# Altium project SFP_RFoF.PrjPcb (part 1 of 2)
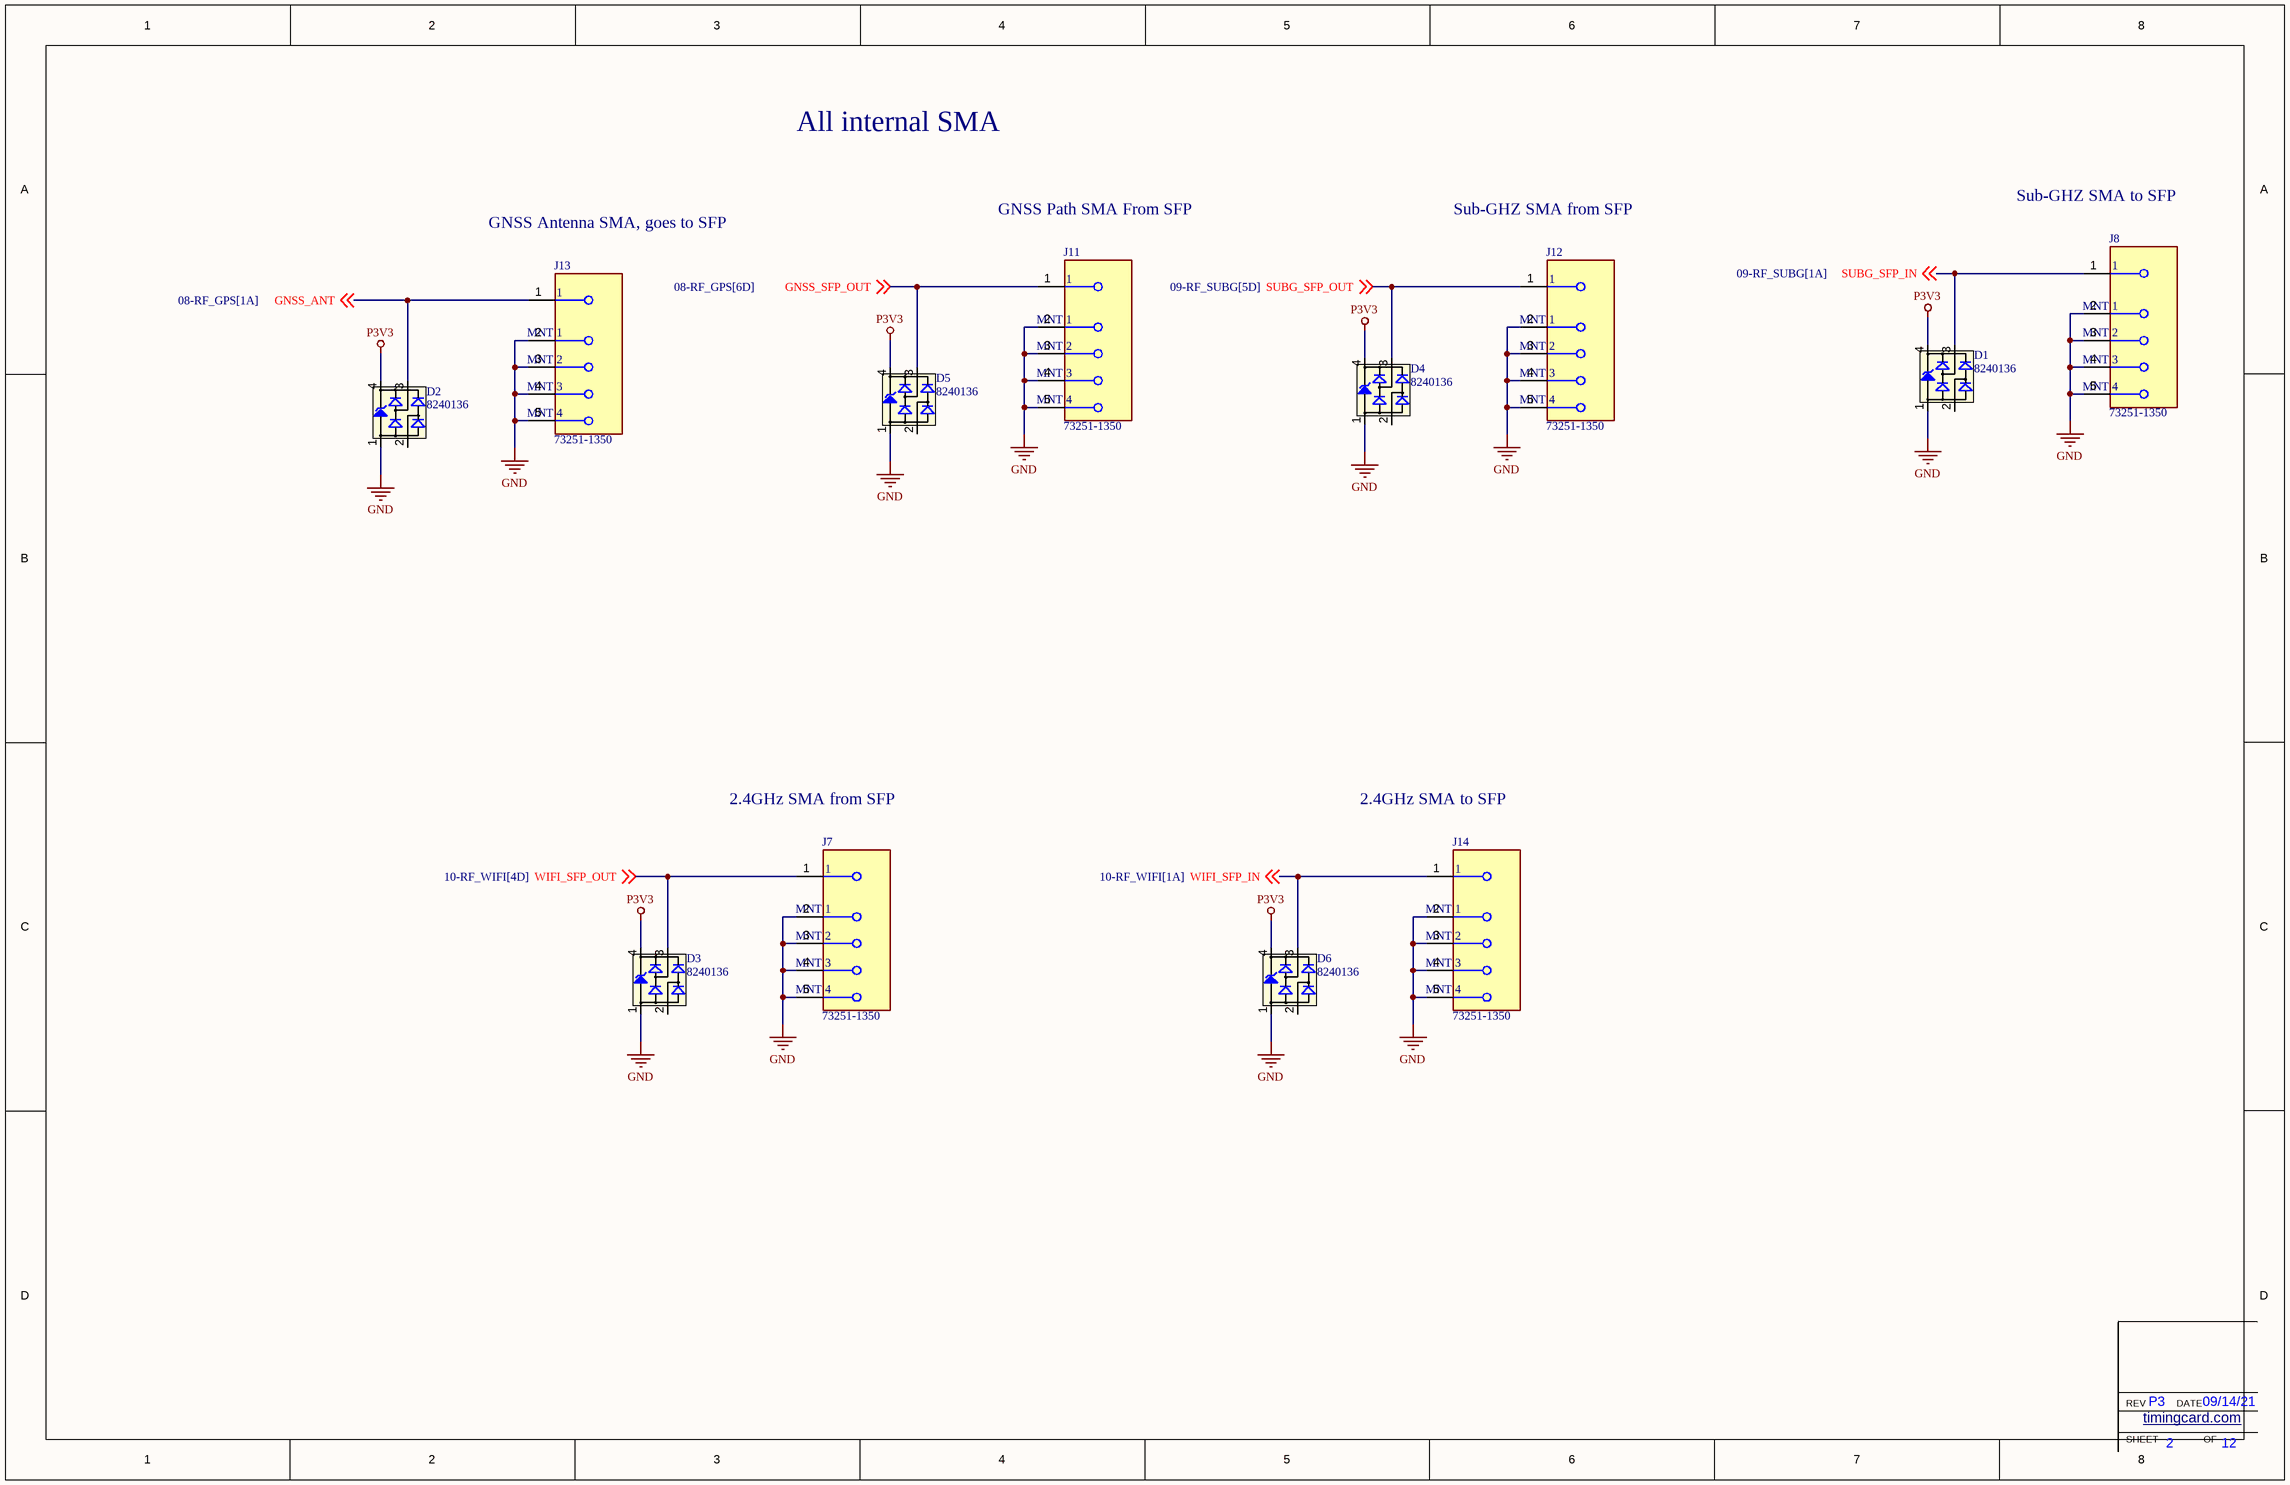
[diagram p0: 02-USER_IO.SchDoc]
ProjectDate: 09/14/21; ProjectRevision: P3
8 sheets, 226 parts. Net scope: global (net labels, ports and power ports of the same name join across sheets).
Board file: SFP_RFoF.PcbDoc
Sheets:
  02-USER_IO.SchDoc
  04-Front Panel SFP_2.SchDoc
  05-General I2C Devices.SchDoc
  06-I225-1.SchDoc
  07-I225-2.SchDoc
  08-RF_GPS.SchDoc
  09-RF_SUBG.SchDoc
  10-RF_WIFI.SchDoc

## Sheet 02-USER_IO.SchDoc
size Tabloid; DocumentNumber: 1; SheetNumber: 2; SheetTotal: 12

### Parts
D1  8240136  [SOT143-4L]
D2  8240136  [SOT143-4L]
D3  8240136  [SOT143-4L]
D4  8240136  [SOT143-4L]
D5  8240136  [SOT143-4L]
D6  8240136  [SOT143-4L]
J7  73251-1350  [FP-73251-1350-MFG]
J8  73251-1350  [FP-73251-1350-MFG]
J11  73251-1350  [FP-73251-1350-MFG]
J12  73251-1350  [FP-73251-1350-MFG]
J13  73251-1350  [FP-73251-1350-MFG]
J14  73251-1350  [FP-73251-1350-MFG]

### Nets
GND: D1.1(GND) D2.1(GND) D3.1(GND) D4.1(GND) D5.1(GND) D6.1(GND) J7.2(MNT_1) J7.3(MNT_2) J7.4(MNT_3) J7.5(MNT_4) J8.2(MNT_1) J8.3(MNT_2) J8.4(MNT_3) J8.5(MNT_4) J11.2(MNT_1) J11.3(MNT_2) J11.4(MNT_3) J11.5(MNT_4) J12.2(MNT_1) J12.3(MNT_2) J12.4(MNT_3) J12.5(MNT_4) J13.2(MNT_1) J13.3(MNT_2) J13.4(MNT_3) J13.5(MNT_4) J14.2(MNT_1) J14.3(MNT_2) J14.4(MNT_3) J14.5(MNT_4)
P3V3: D1.4(VDD) D2.4(VDD) D3.4(VDD) D4.4(VDD) D5.4(VDD) D6.4(VDD)
GNSS_ANT: D2.3(I/O2) J13.1 ; off-sheet GNSS_ANT
GNSS_SFP_OUT: D5.3(I/O2) J11.1 ; off-sheet GNSS_SFP_OUT
SUBG_SFP_IN: D1.3(I/O2) J8.1 ; off-sheet SUBG_SFP_IN
SUBG_SFP_OUT: D4.3(I/O2) J12.1 ; off-sheet SUBG_SFP_OUT
WIFI_SFP_IN: D6.3(I/O2) J14.1 ; off-sheet WIFI_SFP_IN
WIFI_SFP_OUT: D3.3(I/O2) J7.1 ; off-sheet WIFI_SFP_OUT

Not connected (* = marked no-connect by the designer): D1 2(I/O1); D2 2(I/O1); D3 2(I/O1); D4 2(I/O1); D5 2(I/O1); D6 2(I/O1)

### Notes on the sheet
- All internal SMA
- GNSS Antenna SMA, goes to SFP
- GNSS Path SMA From SFP
- Sub-GHZ SMA from SFP
- Sub-GHZ SMA to SFP
- 2.4GHz SMA from SFP
- 2.4GHz SMA to SFP
- SHEET
- REV
- timingcard.com <http://timingcard.com>
- DATE
- OF

### Library data of the parts
D1-D6 = CMP-1486-00002-1: TVS Diode WE-TVS-HS, VRWM=3.3V; Manufacturer: Wuerth Elektronik; Reverse Stand Off Voltage: 3.3V; PartNumber: 8240136; ComponentLink1Description: Manufacturer URL; PackageReference: SOT143-4L; ComponentLink1URL: http://www.we-online.com; ComponentLink2Description: Datasheet; ComponentLink2URL: http://katalog.we-online.de/kataloge/eisos/media/pdf/8240136.pdf
J7 J8 J11-J14 = CMP-04764-000006-1: CONN SMA JACK STR 50 OHM SMD; Manufacturer: Molex; Is Female: yes; Standoff Height: 0.41mm; Impedance: 50Ω; Number Of Contacts: 1; Conn Orientation: Straight; Voltage Rating: 500V; Shielding: true; Frequency: 18GHz; Package: 73251-1350; Device Class L1: Connectors; Category: Conn; Manufacturer Part Number: 73251-1350; ComponentLink2URL: https://www.molex.com/pdm_docs/sd/732511350_sd.pdf; Automotive: No; Height: 9.655mm; Octopart: https://octopart.com/73251-1350-molex-5414390; Footprint Url: https://forum.upverter.com/uploads/default/original/3X/d/a/daeafa2ce4908d4fc4e49f0b17d7d2c986fce444.pdf; Temperature Range High: +165°C; Device Class L3: unset; Mouser Description: RF Connectors / Coaxial Connectors SMA ST PCB-JCK STD SMT; Lead Free: Yes; Temperature: -65°C to +165°C; RoHS: TRUE; ComponentLink2Description: Datasheet; Device Class L2: RF / Coaxial Connectors; Digikey Description: CONN SMA JACK STR 50 OHM SMD; Contact Material: Gold; Temperature Range Low: -65°C

## Sheet 04-Front Panel SFP_2.SchDoc
size B; SheetNumber: 4; SheetTotal: 12
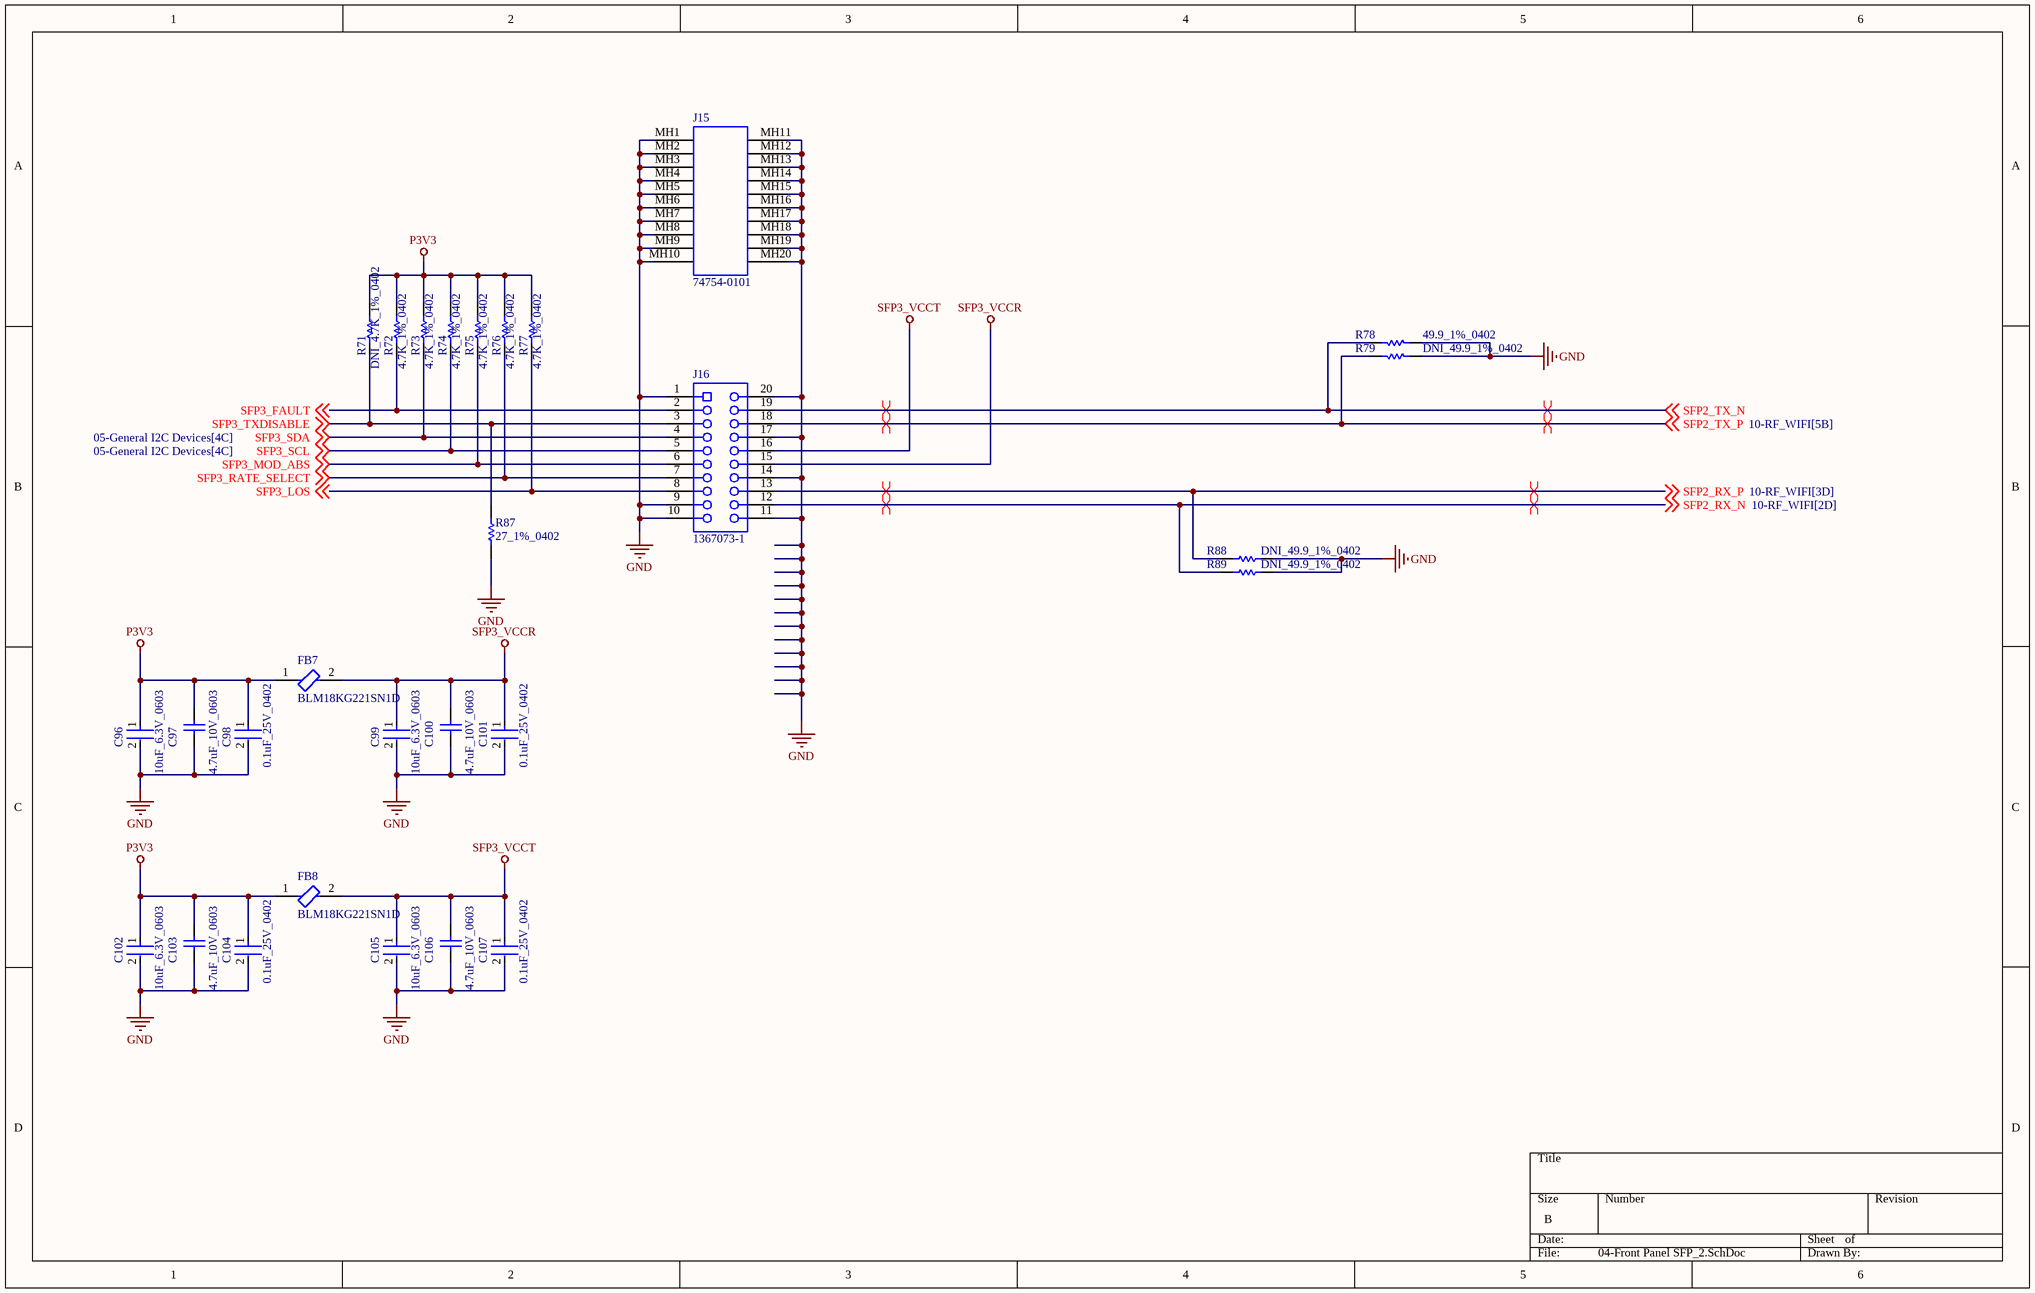
[diagram p1: 04-Front Panel SFP_2.SchDoc]

### Parts
C96  10uF_6.3V_0603  [FP-C0603C106M9PACTU-MFG]
C97  4.7uF_10V_0603  [CAPC1608X87X35NL15T15]
C98  0.1uF_25V_0402  [FP-0402-L_1_0_1-W_0_5_0_1-IPC_C]
C99  10uF_6.3V_0603  [FP-C0603C106M9PACTU-MFG]
C100  4.7uF_10V_0603  [CAPC1608X87X35NL15T15]
C101  0.1uF_25V_0402  [FP-0402-L_1_0_1-W_0_5_0_1-IPC_C]
C102  10uF_6.3V_0603  [FP-C0603C106M9PACTU-MFG]
C103  4.7uF_10V_0603  [CAPC1608X87X35NL15T15]
C104  0.1uF_25V_0402  [FP-0402-L_1_0_1-W_0_5_0_1-IPC_C]
C105  10uF_6.3V_0603  [FP-C0603C106M9PACTU-MFG]
C106  4.7uF_10V_0603  [CAPC1608X87X35NL15T15]
C107  0.1uF_25V_0402  [FP-0402-L_1_0_1-W_0_5_0_1-IPC_C]
FB7  BLM18KG221SN1D  [FP-BLM18-0_15-t0_8-IPC_B]
FB8  BLM18KG221SN1D  [FP-BLM18-0_15-t0_8-IPC_B]
J15  74754-0101  [MOLX-74754-0101_V]
J16  1367073-1  [TECO-1367073-1_V]
R71  DNI_4.7K_1%_0402  [RESC1005X40X25NL10T10]  (no BOM)
R72  4.7K_1%_0402  [RESC1005X40X25NL10T10]
R73  4.7K_1%_0402  [RESC1005X40X25NL10T10]
R74  4.7K_1%_0402  [RESC1005X40X25NL10T10]
R75  4.7K_1%_0402  [RESC1005X40X25NL10T10]
R76  4.7K_1%_0402  [RESC1005X40X25NL10T10]
R77  4.7K_1%_0402  [RESC1005X40X25NL10T10]
R78  49.9_1%_0402  [RESC1005X40X25NL10T10]
R79  DNI_49.9_1%_0402  [RESC1005X40X25NL10T10]  (no BOM)
R87  27_1%_0402  [RESC1005X40X25NL05T05]
R88  DNI_49.9_1%_0402  [RESC1005X40X25NL10T10]  (no BOM)
R89  DNI_49.9_1%_0402  [RESC1005X40X25NL10T10]  (no BOM)

### Nets
GND: C96.2 C97.1 C98.2 C99.2 C100.1 C101.2 C102.2 C103.1 C104.2 C105.2 C106.1 C107.2 J15.MH1 J15.MH2 J15.MH3 J15.MH4 J15.MH5 J15.MH6 J15.MH7 J15.MH8 J15.MH9 J15.MH10 J15.MH11 J15.MH12 J15.MH13 J15.MH14 J15.MH15 J15.MH16 J15.MH17 J15.MH18 J15.MH19 J15.MH20 J16.1 J16.9 J16.10 J16.11 J16.14 J16.17 J16.20 R78.2 R79.2 R87.1 R88.2 R89.2
P3V3: C96.1 C97.2 C98.1 C102.1 C103.2 C104.1 FB7.1 FB8.1 R71.1 R72.1 R73.1 R74.1 R75.1 R76.1 R77.1
SFP3_VCCR: C99.1 C100.2 C101.1 FB7.2 J16.15
SFP3_VCCT: C105.1 C106.2 C107.1 FB8.2 J16.16
SFP2_RX_N: J16.12 R89.1 ; off-sheet SFP2_RX_N
SFP2_RX_P: J16.13 R88.1 ; off-sheet SFP2_RX_P
SFP2_TX_N: J16.19 R78.1 ; off-sheet SFP2_TX_N
SFP2_TX_P: J16.18 R79.1 ; off-sheet SFP2_TX_P
SFP3_FAULT: J16.2 R72.2 ; off-sheet SFP3_FAULT
SFP3_LOS: J16.8 R77.2 ; off-sheet SFP3_LOS
SFP3_MOD_ABS: J16.6 R75.2 ; off-sheet SFP3_MOD_ABS
SFP3_RATE_SELECT: J16.7 R76.2 ; off-sheet SFP3_RATE_SELECT
SFP3_SCL: J16.5 R74.2 ; off-sheet SFP3_SCL
SFP3_SDA: J16.4 R73.2 ; off-sheet SFP3_SDA
SFP3_TXDISABLE: J16.3 R71.2 R87.2 ; off-sheet SFP3_TXDISABLE

### Layout directives
differential pair: SFP2_RX_N, SFP2_RX_P, SFP2_TX_N, SFP2_TX_P

### Library data of the parts
C96 C99 C102 C105 = CMP-2006-02285-3: CAP CER 10UF 6.3V X5R 0603; Manufacturer Part Number: C0603C106M9PACTU; Manufacturer: Kemet; Material: Ceramic; Temperature Coefficient: 15%; Tolerance: 20%; Category: Cap; Height: 0.9mm; Digikey Description: CAP CER 10UF 6.3V X5R 0603; Mouser Description: In a Pack of 10, KEMET 0603 (1608M) 10µF MLCC 6.3V dc ±20% SMD C0603C106M9PACTU; Voltage Rating: 6.3V; Device Class L2: Capacitors; Temperature Range Low: -55°C; Temperature Characteristic: X5R; ComponentLink2Description: Datasheet; Ipc Land Pattern Name: CAPC16080X80; ComponentLink2URL: http://www.kemet.com/Lists/ProductCatalog/Attachments/19/KEM_C1006_X5R_SMD.pdf; Capacitance: 10uF; Temperature Range High: +85°C; Device Class L3: Ceramic Capacitors; RoHS: TRUE; Automotive: No; Value: 10uF; Temperature: -55°C to +85°C; Device Class L1: Passive Components; Package: C0603C106M9PACTU; Lead Free: Yes; Octopart: https://octopart.com/c0603c106m9pactu-kemet-8375727
C97 C100 C103 C106 = CMP-2006-03238-1: Part Number: C0603C475K8PACTU; Manufacturer: Kemet
C98 C101 C104 C107 = CMP-2008-02519-2: General Purpose Ceramic Capacitor, 0402, 100nF, 10%, X7R, 15%, 25V; Package Quantity: 1; Capacitance: 100nF; Min Operating Temperature: -55°C; Voltage: 25V; Voltage Rating: 25V; Construction: Flat; Max Operating Temperature: 125°C; Radiation Hardening: No; Depth: 0.5mm; Thickness: 0.022inch; Voltage Rating (DC): 25V; Number of Pins: 2; Lead Free: Lead Free; Series: -; REACH SVHC: No SVHC; Length: 1mm; Dielectric: X7R; RoHS Compliant: Yes; Mount: Surface Mount; Packaging: Tape and Reel; Case/Package: 0402; Case Code (Imperial): 0402; Termination: SMD/SMT; Width: 0.02inch; Case Code (Metric): 1005; Tolerance: 10%
FB7 FB8 = CMP-0686-00556-7: Chip Ferrite Bead, 0603, 220Ω @ 100MHz, 0.05Ω, 25%, 2.2A; DC Resistance (DCR): 50mR; Number of Circuits: 1; Impedance: 220R; Current Rating: 2.2A; Material: Ferrite; Test Frequency: 100MHz; Depth: 0.8mm; Series: BLM18K; RoHS Compliant: Yes; Termination: SMD/SMT; Max Current Rating: 2.2A; Case Code (Metric): 1608; Radiation Hardening: No; Number of Pins: 2; Length: 1.6mm; Lead Free: Lead Free; Package Quantity: 1; Height: 0.8mm; Core Material: Ferrite; Inductor Type: FERRITE BEAD; Min Operating Temperature: -55°C; Case/Package: 0603; Case Code (Imperial): 0603; Number of Lines: 1; Packaging: Tape and Reel; REACH SVHC: No SVHC; Max Operating Temperature: 125°C; Military Standard: Not; DC Resistance-Max: 50mR; Width: 0.8mm; DC Current: 2.2A; Max DC Current: 2.2A; Tolerance: 25%; Weight: 7.1E-05oz
J15 = CMP-1704-00003-3: SFP+ Cage, Single Port, Height 10.85 mm, Tail Height 3.05 mm, -40 to 85 degC, RoHS, Tray; RoHSCompliant: True; ComponentLink3URL: http://www.molex.com/pdm_docs/sd/747540101_sd.pdf; Width: 49 mm; Height: 10.85 mm; Mounting Technology: Through Hole; ComponentLink2Description: Datasheet; ComponentLink3Description: Package Specification; DatasheetVersion: Rev. Jul-15; Package Quantity: 1152; PackageDescription: SFP+ Cage, Single Port, Height 10.85 mm, Tail Height 3.05 mm; Radiation Hardening: No; PackageVersion: Rev. J, 02/2015; ComponentLink1Description: Manufacturer URL; PartNumber: 74754-0101; ComponentLink1URL: http://www.molex.com/; Packaging: Tray; Length: 15.9 mm; ComponentLink2URL: http://www.molex.com/webdocs/datasheets/pdf/en-us/0747540101_IO_CONNECTORS.pdf
J16 = CMP-2000-05488-1: Female Connector, Pitch 0.8 mm, 2 x 10 Position, Height 5.4 mm, -55 to 85 degC, RoHS, Tape and Reel; Manufacturer: TE Connectivity; Product Training Modules: HighSpeedPluggableI/OSolutions; 3D Model: 1367073-1.pdf; Connector Type: SFP; Other Names: A97430DKR; Mating Products: 516-2084-ND / -TXRXOPTICALSFF1.25GBDISCSI; Dynamic Catalog: SFPConnectors; Featured Product: HighSpeedPluggableI-OSolutions; Connector Style: Receptacle; Associated Product: A103997CT-ND / -CONNSFPCAGESINGLEW/OPIPE / A103997TR-ND / -CONNSFPCAGESINGLEW/OPIPE / 1367645-3-ND / -CONNCAGE&HEATSINKSGLPORTTIN / 1367645-2-ND / -CONNCAGE&HEATSINKSGLPORTTIN / 1888424-1-ND / -CONNCAGE1X2SFPENHANCEDEMI / 1367643-1-ND / -CONNCAGESNGLPORTDBLSIDETIN / 1489962-1-ND / -CONNSFPCAGESINGLEW/OPIPE / 1367645-1-ND / -CONNCAGE&HEATSINKSGLPORTTIN / A99375-ND / -CONNSFPCAGE1X4PIN-IN-PASTE / A97412CT-ND / -CONNSFPLOWERCAGEPCB / More...; Number of Positions: 20; Package Reference: 1367073-1; Package Description: Female Connector, Pitch 0.8 mm, 2 x 10 Position, Height 5.4 mm; RoHS Information: 1367073-1StatementofCompliance; Contact Finish: Gold; Datasheet URL: http://www.te.com/commerce/DocumentDelivery/DDEController?Action=showdoc&DocId=Customer+Drawing%7F1367073%7FK%7Fpdf%7FEnglish%7FENG_CD_1367073_K.pdf%7F1367073-1; Datasheet Version: Rev. K, 12/2012; Contact Finish Thickness: 15µin(0.38µm); Category: Connectors,Interconnects; Mounting Type: SurfaceMount,RightAngle; Mounting Technology: SurfaceMount; Packaging: Digi-Reel®; Manufacturer URL: http://www.te.com/; Family: PluggableConnectors; Standard Package: 1; Termination: Solder
R71-R77 = CMP-2002-05217-1: Manufacturer: Bourns; Part Number: CR0402-FX-4701GLF
R78 R79 R88 R89 = CMP-2002-04448-1: Part Number: RK73H1ETTP49R9F; Manufacturer: KOA Speer
R87 = CMP-2002-08434-1: Part Number: CRCW040227R0FKED; Manufacturer: Vishay Dale

## Sheet 05-General I2C Devices.SchDoc
size B; SheetNumber: 5; SheetTotal: 12
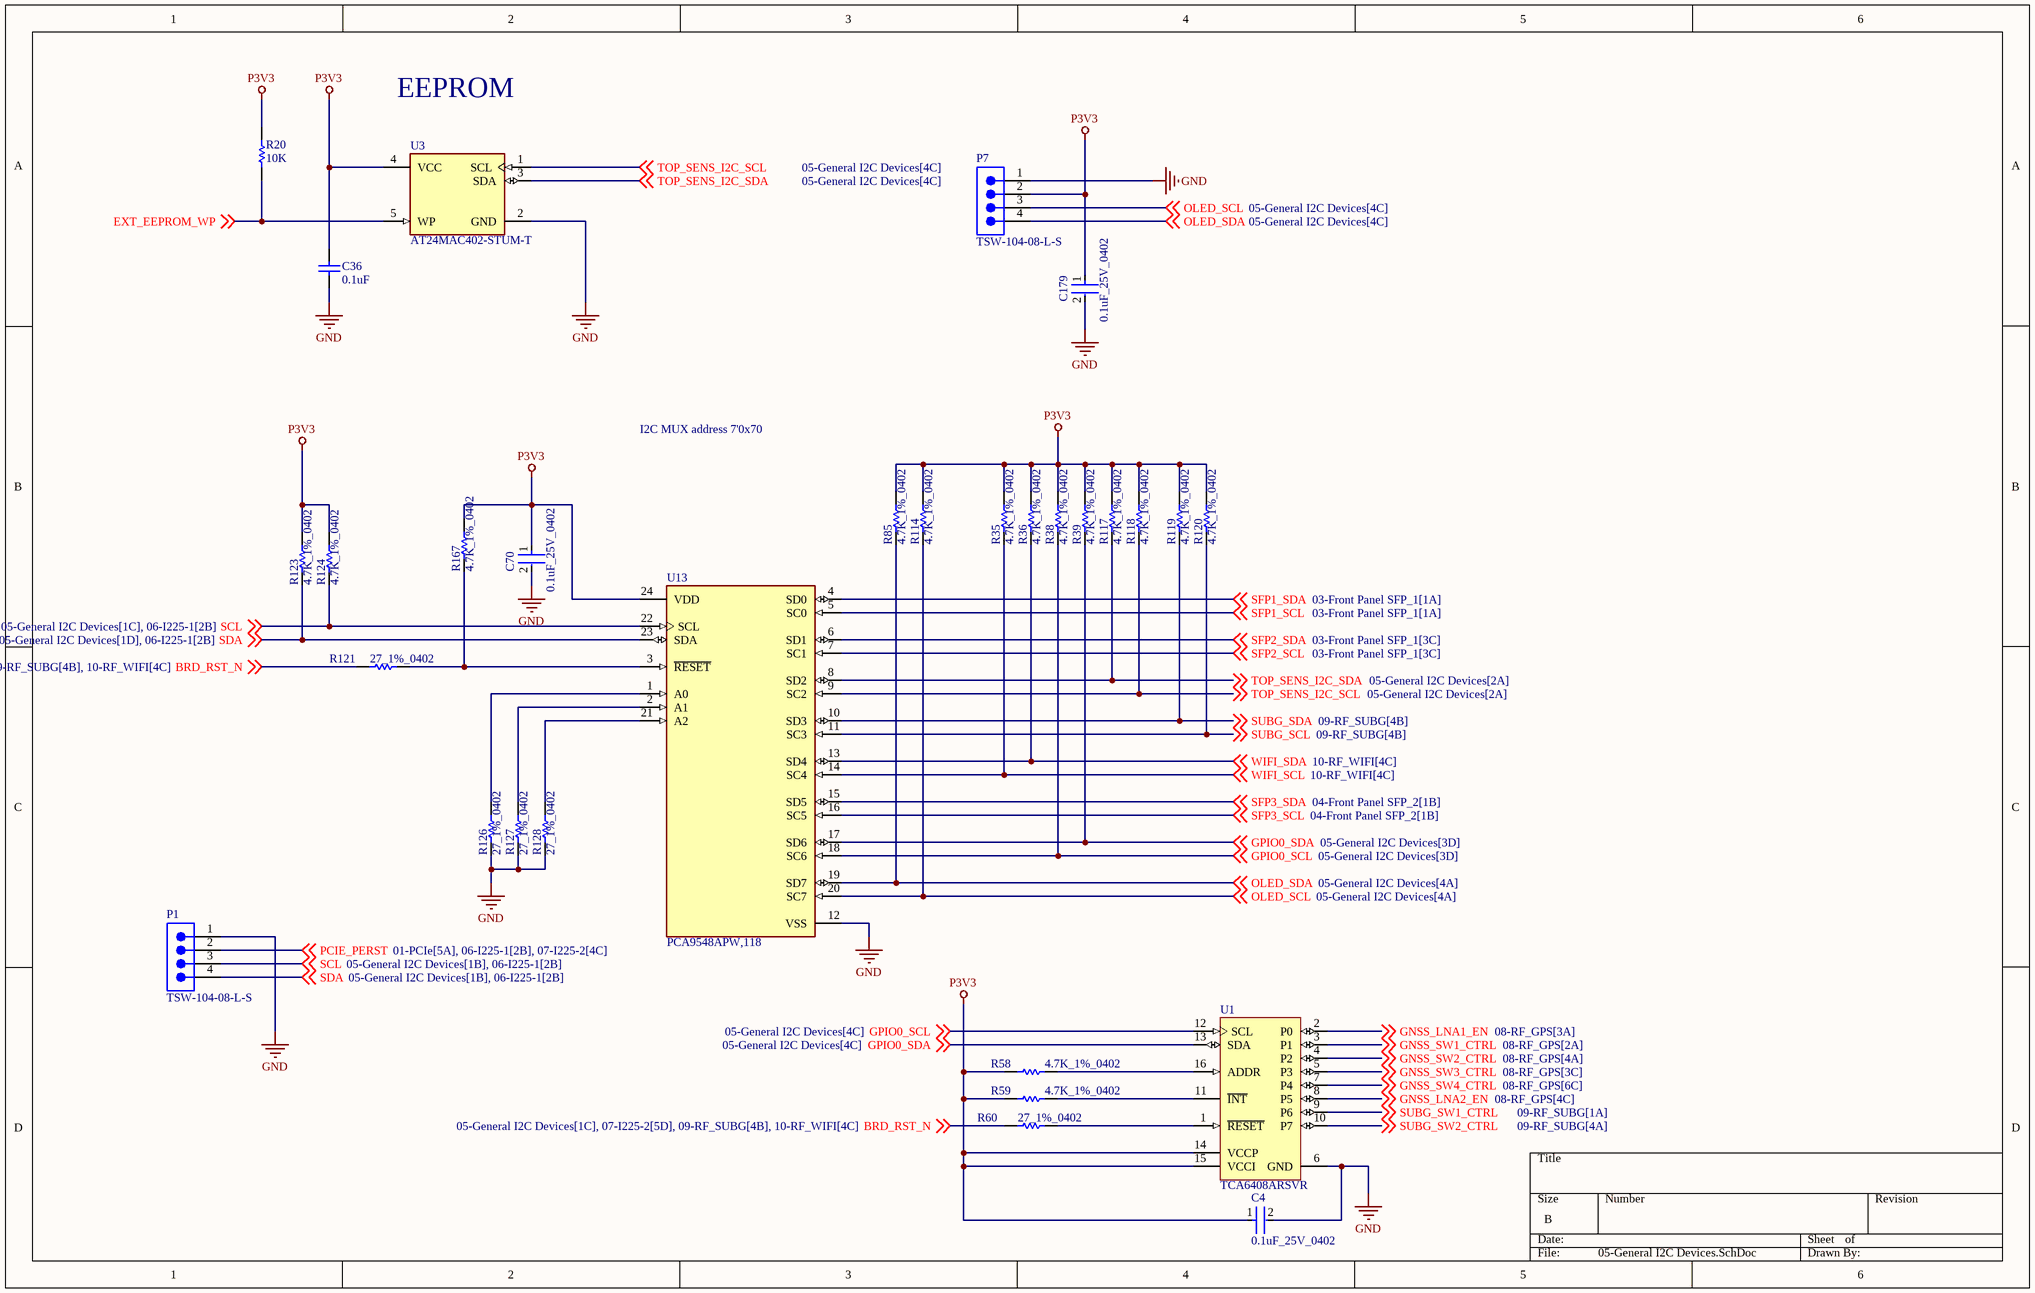
[diagram p2: 05-General I2C Devices.SchDoc]

### Parts
C4  0.1uF_25V_0402  [FP-0402-L_1_0_1-W_0_5_0_1-IPC_C]
C36  0.1uF  [CAPC1608X87X45ML20T05]
C70  0.1uF_25V_0402  [FP-0402-L_1_0_1-W_0_5_0_1-IPC_C]
C179  0.1uF_25V_0402  [FP-0402-L_1_0_1-W_0_5_0_1-IPC_C]
P1  TSW-104-08-L-S  [SMTC-TSW-104-08-X-S]
P7  TSW-104-08-L-S  [SMTC-TSW-104-08-X-S]
R20  10K  [RESC1608X55X30LL15T20]
R35  4.7K_1%_0402  [RESC1005X40X25NL10T10]
R36  4.7K_1%_0402  [RESC1005X40X25NL10T10]
R38  4.7K_1%_0402  [RESC1005X40X25NL10T10]
R39  4.7K_1%_0402  [RESC1005X40X25NL10T10]
R58  4.7K_1%_0402  [RESC1005X40X25NL10T10]
R59  4.7K_1%_0402  [RESC1005X40X25NL10T10]
R60  27_1%_0402  [RESC1005X40X25NL05T05]
R85  4.7K_1%_0402  [RESC1005X40X25NL10T10]
R114  4.7K_1%_0402  [RESC1005X40X25NL10T10]
R117  4.7K_1%_0402  [RESC1005X40X25NL10T10]
R118  4.7K_1%_0402  [RESC1005X40X25NL10T10]
R119  4.7K_1%_0402  [RESC1005X40X25NL10T10]
R120  4.7K_1%_0402  [RESC1005X40X25NL10T10]
R121  27_1%_0402  [RESC1005X40X25NL05T05]
R123  4.7K_1%_0402  [RESC1005X40X25NL10T10]
R124  4.7K_1%_0402  [RESC1005X40X25NL10T10]
R126  27_1%_0402  [RESC1005X40X25NL05T05]
R127  27_1%_0402  [RESC1005X40X25NL05T05]
R128  27_1%_0402  [RESC1005X40X25NL05T05]
R167  4.7K_1%_0402  [RESC1005X40X25NL10T10]
U1  TCA6408ARSVR  [RSV0016A_V]
U3  AT24MAC402-STUM-T  [FP-5TS1-IPC_C]
U13  PCA9548APW,118  [FP-SOT355-1-MFG]

### Nets
GND: C4.2 C36.1 C70.2 C179.2 P1.1 P7.1 R126.1 R127.1 R128.1 U1.6(GND) U3.2(GND) U13.12(VSS)
P3V3: C4.1 C36.2 C70.1 C179.1 P7.2 R20.2 R35.2 R36.2 R38.2 R39.2 R58.2 R59.2 R85.2 R114.2 R117.2 R118.2 R119.2 R120.2 R123.2 R124.2 R167.2 U1.14(VCCP) U1.15(VCCI) U3.4(VCC) U13.24(VDD)
BRD_RST_N: R60.1 R121.1 ; off-sheet BRD_RST_N
EXT_EEPROM_WP: R20.1 U3.5(WP) ; off-sheet EXT_EEPROM_WP
GNSS_LNA1_EN: U1.2(P0) ; off-sheet GNSS_LNA1_EN
GNSS_LNA2_EN: U1.8(P5) ; off-sheet GNSS_LNA2_EN
GNSS_SW1_CTRL: U1.3(P1) ; off-sheet GNSS_SW1_CTRL
GNSS_SW2_CTRL: U1.4(P2) ; off-sheet GNSS_SW2_CTRL
GNSS_SW3_CTRL: U1.5(P3) ; off-sheet GNSS_SW3_CTRL
GNSS_SW4_CTRL: U1.7(P4) ; off-sheet GNSS_SW4_CTRL
GPIO0_SCL: R38.1 U1.12(SCL) U13.18(SC6) ; off-sheet GPIO0_SCL
GPIO0_SDA: R39.1 U1.13(SDA) U13.17(SD6) ; off-sheet GPIO0_SDA
OLED_SCL: P7.3 R114.1 U13.20(SC7) ; off-sheet OLED_SCL
OLED_SDA: P7.4 R85.1 U13.19(SD7) ; off-sheet OLED_SDA
PCIE_PERST: P1.2 ; off-sheet PCIE_PERST
SCL: P1.3 R124.1 U13.22(SCL) ; off-sheet SCL
SDA: P1.4 R123.1 U13.23(SDA) ; off-sheet SDA
SFP1_SCL: U13.5(SC0) ; off-sheet SFP1_SCL
SFP1_SDA: U13.4(SD0) ; off-sheet SFP1_SDA
SFP2_SCL: U13.7(SC1) ; off-sheet SFP2_SCL
SFP2_SDA: U13.6(SD1) ; off-sheet SFP2_SDA
SFP3_SCL: U13.16(SC5) ; off-sheet SFP3_SCL
SFP3_SDA: U13.15(SD5) ; off-sheet SFP3_SDA
SUBG_SCL: R120.1 U13.11(SC3) ; off-sheet SUBG_SCL
SUBG_SDA: R119.1 U13.10(SD3) ; off-sheet SUBG_SDA
SUBG_SW1_CTRL: U1.9(P6) ; off-sheet SUBG_SW1_CTRL
SUBG_SW2_CTRL: U1.10(P7) ; off-sheet SUBG_SW2_CTRL
TOP_SENS_I2C_SCL: R118.1 U3.1(SCL) U13.9(SC2) ; off-sheet TOP_SENS_I2C_SCL
TOP_SENS_I2C_SDA: R117.1 U3.3(SDA) U13.8(SD2) ; off-sheet TOP_SENS_I2C_SDA
WIFI_SCL: R35.1 U13.14(SC4) ; off-sheet WIFI_SCL
WIFI_SDA: R36.1 U13.13(SD4) ; off-sheet WIFI_SDA
NetR58_1: R58.1 U1.16(ADDR)
NetR59_1: R59.1 U1.11(~{INT})
NetR60_2: R60.2 U1.1(~{RESET})
NetR121_2: R121.2 R167.1 U13.3(~{RESET})
NetR126_2: R126.2 U13.1(A0)
NetR127_2: R127.2 U13.2(A1)
NetR128_2: R128.2 U13.21(A2)

### Notes on the sheet
- EEPROM
- I2C MUX address 7'0x70

### Library data of the parts
C4 C70 C179 = CMP-2008-02519-2: as C98 on sheet 04-Front Panel SFP_2; Package Quantity: 1; Capacitance: 100nF; Min Operating Temperature: -55°C; Voltage: 25V; Voltage Rating: 25V; Construction: Flat; Max Operating Temperature: 125°C; Radiation Hardening: No; Depth: 0.5mm; Thickness: 0.022inch; Voltage Rating (DC): 25V; Number of Pins: 2; Lead Free: Lead Free; Series: -; REACH SVHC: No SVHC; Length: 1mm; Dielectric: X7R; RoHS Compliant: Yes; Mount: Surface Mount; Packaging: Tape and Reel; Case/Package: 0402; Case Code (Imperial): 0402; Termination: SMD/SMT; Width: 0.02inch; Case Code (Metric): 1005; Tolerance: 10%
C36 = CMP-2006-00003-1: C0603X104K5RACAUTO; Manufacturer: Kemet; Part Number: C0603X104K5RACAUTO
P1 P7 = CMP-1024-00358-1: 0.025" SQ Post Header, Through-hole, Vertical, -55 to 125 degC, 2.54 mm Pitch, 4-Pin, Male, RoHS; Manufacturer: Samtec; Pitch: 2.54 mm; PartNumber: TSW-104-08-L-S; RoHS: True; Temperature Range: -55 to 125 degC; PackageDescription: .025[0.64] SQ. Post Terminal Strip Assembly; Orientation: Vertical; ComponentLink2URL: http://www.samtec.com/documents/webfiles/pdf/TSW_TH.PDF; ComponentLink1Description: Manufacturer URL; ComponentLink2Description: Datasheet; PackageVersion: DM, 8/1988; ComponentLink3URL: http://www.samtec.com/documents/webfiles/cpdf/TSW-XXX-XX-XXX-X-XX-XXX-MKT.pdf; Mounting Technology: Through-hole; PackageReference: TSW-104-08-X-S; ComponentLink3Description: Package Specification; ComponentLink1URL: http://www.samtec.com; DatasheetVersion: F-214
R20 = CMP-2000-06990-1: Chip Resistor, 10 KOhm, +/- 1%, 0.1 W, -55 to 155 degC, 0603 (1608 Metric), RoHS, Tape and Reel RMCF0603FT10K0; Manufacturer: Stackpole-Electronics-Inc.; Temperature Coefficient: ±100ppm/°C; Power (Watts): 0.1W,1/10W; Package / Case: 0603(1608Metric); Datasheet Version: 01/2017; Resistance (Ohms): 10k; Features: AutomotiveAEC-Q200; Packaging: CutTape(CT); Series: RMCF; Height: 0.022"(0.55mm); Tolerance: ±1%; Manufacturer URL: https://www.seielect.com/; Datasheet URL: https://www.seielect.com/Catalog/SEI-RMCF_RMCP.pdf; Supplier Device Package: 0603; Number of Terminations: 2; Family: ChipResistor-SurfaceMount; Package Reference: 0603; Size / Dimension: 0.061"Lx0.031"W(1.55mmx0.80mm); Mounting Technology: SurfaceMount; Package Description: 2-Pin Surface Mount Device, Body 1.55 x 0.8 mm; Operating Temperature: -55°C~155°C; Composition: ThickFilm; Category: Resistors
R35 R36 R38 R39 R58 R59 R85 R114 R117-R120 R123 R124 R167 = CMP-2002-05217-1: as R71 on sheet 04-Front Panel SFP_2
R60 R121 R126-R128 = CMP-2002-08434-1: as R87 on sheet 04-Front Panel SFP_2
U1 = CMP-0314-00021-2: Low-Voltage 8-Bit I2C and SMBus I/O Expander, 1.65 to 5.5 V, -40 to 85 degC, 16-pin UQFN (RSV), Green (RoHS & no Sb/Br); Manufacturer: Texas Instruments; Configuration Registers: Yes; Max Frequency(kHz): 400; # of I/Os: 8; SubFamily: I2C IO Expander; I2C Address: 0100 00x; VCC(Min)(V): 1.65; VCC(Max)(V): 5.5; Reset Input: Yes; ComponentLink2URL: http://www.ti.com/litv/pdf/mpqf115g; PackageVersion: revD, Dec-2011; No. of Outputs: 8; PackageReference: RSV0016A; DatasheetVersion: SCPS192C; fSCLK(Max)(MHz): 400; Mounting Technology: Surface Mount; ComponentLink1Description: Datasheet; Push-Pull I/O Type: Yes; Code_JEDEC: MO-288*; PackageDescription: 16-Leads Plastic Quad Flatpack No-Lead, 2.6 x 1.8 x 0.5 mm Body, 0.4 mm Pitch; ComponentLink1URL: http://www.ti.com/general/docs/lit/getliterature.tsp?genericPartNumber=TCA6408A&fileType=pdf; Interrupt Output: Yes; PartNumber: TCA6408ARSVR; Eco-Plan: Green (RoHS & no Sb/Br); Low Power: Yes; Vcc range(V): 1.65 to 5.5; ComponentLink2Description: Package Specification; 5V Tolerant I/O: Yes
U3 = CMP-06313-000011-1: IC EEPROM 2K I2C 1MHZ SOT23-5; Manufacturer: Microchip; Memory Size: 2Kbits; Min Supply Voltage: 1.7V; Max Supply Voltage: 5.5V; Frequency: 1000kHz; Standoff Height: 0mm; Nominal Supply Current: 0.4-2mA; Access Time: 0.55us; Interface: I2C,2-Wire; Temperature Range Low: -40°C; Height: 1mm; ComponentLink2URL: http://ww1.microchip.com/downloads/en/DeviceDoc/Atmel-8807-SEEPROM-AT24MAC402-602-Datasheet.pdf; Ipc Land Pattern Name: SOT95P280X100-5; Category: IC; Memory Type: EEPROM; Digikey Description: IC EEPROM 2K I2C 1MHZ SOT23-5; Manufacturer Part Number: AT24MAC402-STUM-T; Device Class L1: Integrated Circuits (ICs); Temperature Range High: +85°C; ComponentLink2Description: Datasheet; RoHS: TRUE; Mouser Description: EEPROM Serial-I2C 2K-bit 256 x 8 1.8V/2.5V/3.3V/5V 5-Pin SOT-23 T/R; Octopart: https://octopart.com/at24mac402-stum-t-microchip-77758112; Temperature: -40°C to +85°C; Package: 5TS1; Device Class L3: EEPROM; Automotive: No; Device Class L2: Memory; Lead Free: Yes
U13 = CMP-2000-06880-2: IC INTERFACE SPECIALIZED 24TSSOP; Power Dissipation: 400mW; Low Level Output Current: 9mA; Number of Channels: 16; Max Frequency: 400kHz; Number of Inputs: 8; Number of Outputs: 1; On-State Resistance: 24R; Interface: I2C; Turn-On Delay Time: 300ns; Logic Function: Multiplexer; Nominal Supply Current: 100mA; Operating Supply Current: 65uA; Min Supply Voltage: 2.3V; Propagation Delay: 0.3ns; Max Supply Voltage: 5.5V; Contact Plating: Gold; Max Power Dissipation: 400mW; Mount: Surface Mount; Package Quantity: 2500; Min Operating Temperature: -40°C; Max Operating Temperature: 85°C; Case/Package: TSSOP; Number of Pins: 24; Bandwidth: 400kHz; Quiescent Current: 65uA; Packaging: Tape and Reel; Lead Free: Lead Free; Turn-Off Delay Time: 300ns; Radiation Hardening: No

## Sheet 06-I225-1.SchDoc
size B; SheetNumber: 6; SheetTotal: 12
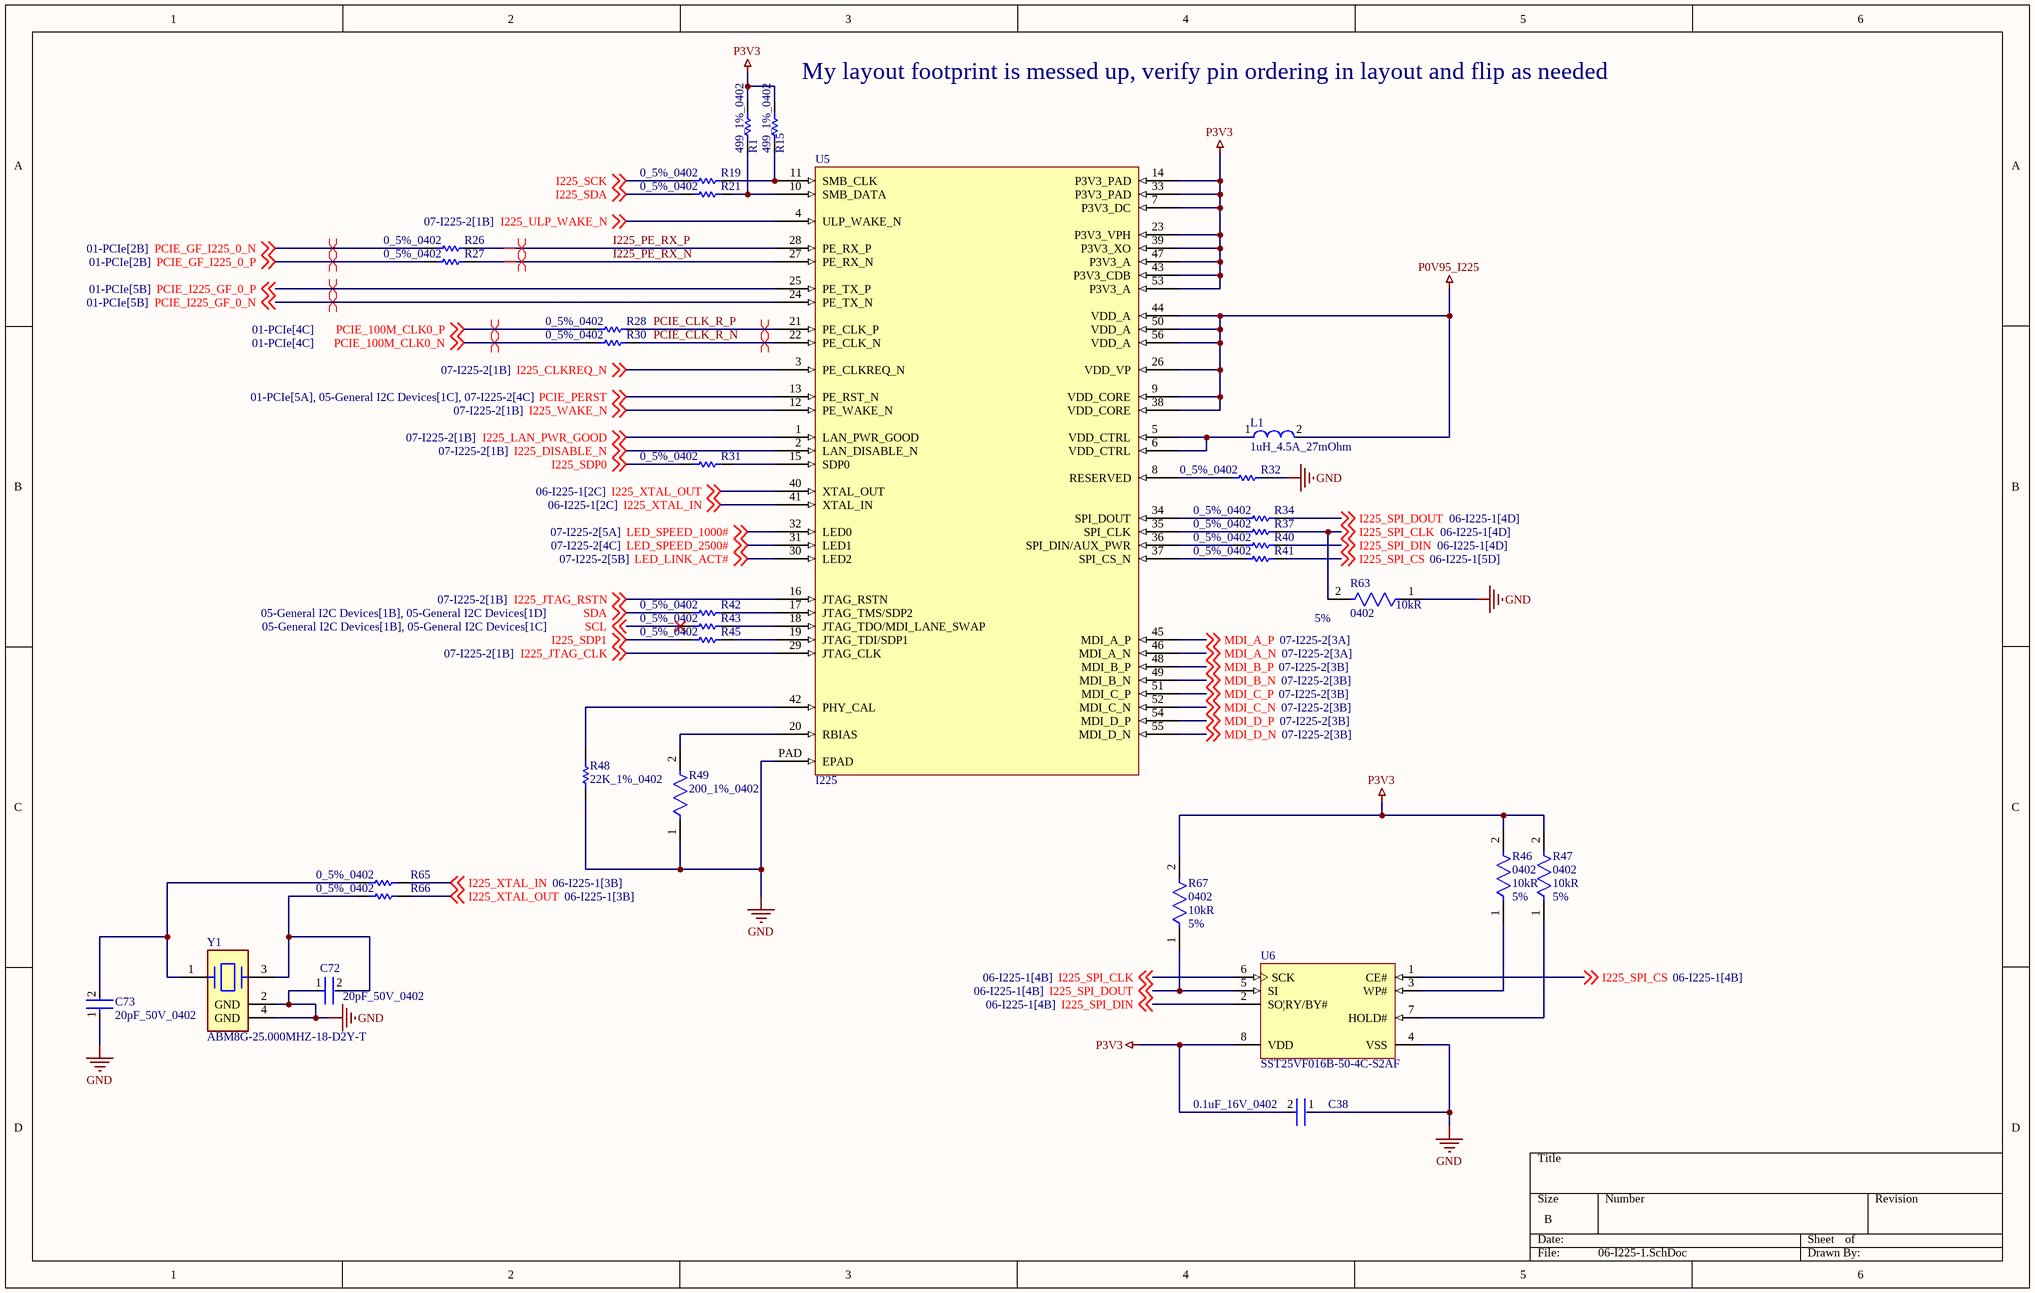
[diagram p3: 06-I225-1.SchDoc]

### Parts
C38  0.1uF_16V_0402  [FP-GRM15-MFG]
C72  20pF_50V_0402  [FP-C0402-BB-MFG]
C73  20pF_50V_0402  [FP-C0402-BB-MFG]
L1  1uH_4.5A_27mOhm  [FP-IHLP-1616BZ-FP_1_8545x-MFG]
R1  499_1%_0402  [RESC1005X40X25LL05T05]
R15  499_1%_0402  [RESC1005X40X25LL05T05]
R19  0_5%_0402  [RESC1005X40X25LL10T10]
R21  0_5%_0402  [RESC1005X40X25LL10T10]
R26  0_5%_0402  [RESC1005X40X25LL10T10]
R27  0_5%_0402  [RESC1005X40X25LL10T10]
R28  0_5%_0402  [RESC1005X40X25LL10T10]
R30  0_5%_0402  [RESC1005X40X25LL10T10]
R31  0_5%_0402  [RESC1005X40X25LL10T10]
R32  0_5%_0402  [RESC1005X40X25LL10T10]
R34  0_5%_0402  [RESC1005X40X25LL10T10]
R37  0_5%_0402  [RESC1005X40X25LL10T10]
R40  0_5%_0402  [RESC1005X40X25LL10T10]
R41  0_5%_0402  [RESC1005X40X25LL10T10]
R42  0_5%_0402  [RESC1005X40X25LL10T10]
R43  0_5%_0402  [RESC1005X40X25LL10T10]
R45  0_5%_0402  [RESC1005X40X25LL10T10]
R46  Case/Package: 0402  Resistance: 10kR  Tolerance: 5%  [FP-CRCW0402-e3-IPC_B]  (hidden comment: CRCW040210K0JNED)
R47  Case/Package: 0402  Resistance: 10kR  Tolerance: 5%  [FP-CRCW0402-e3-IPC_B]  (hidden comment: CRCW040210K0JNED)
R48  22K_1%_0402  [RESC1005X40X25NL05T05]
R49  200_1%_0402  [FP-CRCW0402-e3-IPC_C]
R63  Case/Package: 0402  Resistance: 10kR  Tolerance: 5%  [FP-CRCW0402-e3-IPC_B]  (hidden comment: CRCW040210K0JNED)
R65  0_5%_0402  [RESC1005X40X25LL10T10]
R66  0_5%_0402  [RESC1005X40X25LL10T10]
R67  Case/Package: 0402  Resistance: 10kR  Tolerance: 5%  [FP-CRCW0402-e3-IPC_B]  (hidden comment: CRCW040210K0JNED)
U5  I225  [I225 QFN56]
U6  SST25VF016B-50-4C-S2AF  [MCHP-SOIC-S2A8_M]
Y1  ABM8G-25.000MHZ-18-D2Y-T  [FP-ABM8G-MFG]

### Nets
GND: C38.1 C72.1 C73.1 R32.2 R48.1 R49.1 R63.1 U5.PAD(EPAD) U6.4(VSS) Y1.2(GND) Y1.4(GND)
P0V95_I225: L1.2 U5.9(VDD_CORE) U5.26(VDD_VP) U5.38(VDD_CORE) U5.44(VDD_A) U5.50(VDD_A) U5.56(VDD_A)
P3V3: C38.2 R1.2 R15.2 R46.2 R47.2 R67.2 U5.7(P3V3_DC) U5.14(P3V3_PAD) U5.23(P3V3_VPH) U5.33(P3V3_PAD) U5.39(P3V3_XO) U5.43(P3V3_CDB) U5.47(P3V3_A) U5.53(P3V3_A) U6.8(VDD)
I225_CLKREQ_N: U5.3(PE_CLKREQ_N) ; off-sheet I225_CLKREQ_N
I225_DISABLE_N: U5.2(LAN_DISABLE_N) ; off-sheet I225_DISABLE_N
I225_JTAG_CLK: U5.29(JTAG_CLK) ; off-sheet I225_JTAG_CLK
I225_JTAG_RSTN: U5.16(JTAG_RSTN) ; off-sheet I225_JTAG_RSTN
I225_LAN_PWR_GOOD: U5.1(LAN_PWR_GOOD) ; off-sheet I225_LAN_PWR_GOOD
I225_PE_RX_N: R27.2 U5.27(PE_RX_N)
I225_PE_RX_P: R26.2 U5.28(PE_RX_P)
I225_SCK: R19.1 ; off-sheet I225_SCK
I225_SDA: R21.1 ; off-sheet I225_SDA
I225_SDP0: R31.1 ; off-sheet I225_SDP0
I225_SDP1: R45.1 ; off-sheet I225_SDP1
I225_SPI_CLK: R37.2 R63.2 U6.6(SCK) ; off-sheet I225_SPI_CLK
I225_SPI_CS: R41.2 U6.1(CE#) ; off-sheet I225_SPI_CS
I225_SPI_DIN: R40.2 U6.2(SO|RY/BY#) ; off-sheet I225_SPI_DIN
I225_SPI_DOUT: R34.2 R67.1 U6.5(SI) ; off-sheet I225_SPI_DOUT
I225_ULP_WAKE_N: U5.4(ULP_WAKE_N) ; off-sheet I225_ULP_WAKE_N
I225_WAKE_N: U5.12(PE_WAKE_N) ; off-sheet I225_WAKE_N
I225_XTAL_IN: R65.2 U5.41(XTAL_IN) ; off-sheet I225_XTAL_IN
I225_XTAL_OUT: R66.2 U5.40(XTAL_OUT) ; off-sheet I225_XTAL_OUT
LED_LINK_ACT#: U5.30(LED2) ; off-sheet LED_LINK_ACT#
LED_SPEED_1000#: U5.32(LED0) ; off-sheet LED_SPEED_1000#
LED_SPEED_2500#: U5.31(LED1) ; off-sheet LED_SPEED_2500#
MDI_A_N: U5.46(MDI_A_N) ; off-sheet MDI_A_N
MDI_A_P: U5.45(MDI_A_P) ; off-sheet MDI_A_P
MDI_B_N: U5.49(MDI_B_N) ; off-sheet MDI_B_N
MDI_B_P: U5.48(MDI_B_P) ; off-sheet MDI_B_P
MDI_C_N: U5.52(MDI_C_N) ; off-sheet MDI_C_N
MDI_C_P: U5.51(MDI_C_P) ; off-sheet MDI_C_P
MDI_D_N: U5.55(MDI_D_N) ; off-sheet MDI_D_N
MDI_D_P: U5.54(MDI_D_P) ; off-sheet MDI_D_P
PCIE_100M_CLK0_N: R30.1 ; off-sheet PCIE_100M_CLK0_N
PCIE_100M_CLK0_P: R28.1 ; off-sheet PCIE_100M_CLK0_P
PCIE_CLK_R_N: R30.2 U5.22(PE_CLK_N)
PCIE_CLK_R_P: R28.2 U5.21(PE_CLK_P)
PCIE_GF_I225_0_N: R26.1 ; off-sheet PCIE_GF_I225_0_N
PCIE_GF_I225_0_P: R27.1 ; off-sheet PCIE_GF_I225_0_P
PCIE_I225_GF_0_N: U5.24(PE_TX_N) ; off-sheet PCIE_I225_GF_0_N
PCIE_I225_GF_0_P: U5.25(PE_TX_P) ; off-sheet PCIE_I225_GF_0_P
PCIE_PERST: U5.13(PE_RST_N) ; off-sheet PCIE_PERST
SCL: R43.1 ; off-sheet SCL
SDA: R42.1 ; off-sheet SDA
NetC72_2: C72.2 R66.1 Y1.3
NetC73_2: C73.2 R65.1 Y1.1
NetL1_1: L1.1 U5.5(VDD_CTRL) U5.6(VDD_CTRL)
NetR1_1: R1.1 R21.2 U5.10(SMB_DATA)
NetR15_1: R15.1 R19.2 U5.11(SMB_CLK)
NetR31_2: R31.2 U5.15(SDP0)
NetR32_1: R32.1 U5.8(RESERVED)
NetR34_1: R34.1 U5.34(SPI_DOUT)
NetR37_1: R37.1 U5.35(SPI_CLK)
NetR40_1: R40.1 U5.36(SPI_DIN/AUX_PWR)
NetR41_1: R41.1 U5.37(SPI_CS_N)
NetR42_2: R42.2 U5.17(JTAG_TMS/SDP2)
NetR43_2: R43.2 U5.18(JTAG_TDO/MDI_LANE_SWAP)
NetR45_2: R45.2 U5.19(JTAG_TDI/SDP1)
NetR46_1: R46.1 U6.3(WP#)
NetR47_1: R47.1 U6.7(HOLD#)
NetR48_2: R48.2 U5.42(PHY_CAL)
NetR49_2: R49.2 U5.20(RBIAS)

### Layout directives
differential pair: I225_PE_RX_N, I225_PE_RX_P, PCIE_100M_CLK0_N, PCIE_100M_CLK0_P, PCIE_CLK_R_N, PCIE_CLK_R_P, PCIE_GF_I225_0_N, PCIE_GF_I225_0_P, PCIE_I225_GF_0_N, PCIE_I225_GF_0_P

### Notes on the sheet
- My layout footprint is messed up, verify pin ordering in layout and flip as needed

### Library data of the parts
C38 = CMP-2100-03641-2: CAP CER 0.1UF 16V X7R 0402; Manufacturer Part Number: GRM155R71C104KA88D; Manufacturer: Murata; Standoff Height: 0mm; Tolerance: 10%; Voltage Rating: 16Vdc; Material: Ceramic; Capacitance: 0.10μF; Value: 0.10μF; RoHS: TRUE; Temperature Characteristic: X7R; Octopart: https://octopart.com/grm155r71c104ka88d-murata-196880; Digikey Description: CAP CER 0.1UF 16V X7R 0402; Device Class L3: Ceramic Capacitors; Height: 0.55mm; ComponentLink2Description: Datasheet; Temperature Range Low: -55°C; Ipc Land Pattern Name: CAPC10050X219; ComponentLink2URL: https://search.murata.co.jp/Ceramy/image/img/A01X/G101/ENG/GRM155R71H471KA01-01A.pdf; Device Class L1: Passive Components; Lead Free: yes; Category: Cap; Package: GRM15; Temperature: -55°C to +125°C; Device Class L2: Capacitors; Temperature Range High: +125°C; Mouser Description: 0402 0.1 uF 16V ±10 % Tolerance X7R SMT Multilayer Ceramic Capacitor
C72 C73 = CMP-1034-00890-3: CAP CER 20PF 50V 5% NP0 0402; Manufacturer Part Number: C0402C200J5GACTU; Manufacturer: Kemet; Tolerance: 0.05; Material: Ceramic; Temperature Characteristic: C0G; Temperature Coefficient: 15%; Octopart: https://octopart.com/c0402c200j5gactu-kemet-9143900; ComponentLink2Description: Datasheet; RoHS: TRUE; Ipc Land Pattern Name: CAPC10050X50; Temperature: -55°C to +125°C; Lead Free: Yes; Mouser Description: Multilayer Ceramic Capacitors MLCC - SMD/SMT 50volts 20pF C0G 5%; Device Class L1: Passive Components; Category: Cap; Package: C0402-BB; Temperature Range High: +125°C; Voltage Rating: 50 V; Temperature Range Low: -55°C; Device Class L2: Capacitors; Device Class L3: Ceramic Capacitors; Height: 0.55mm; Capacitance: 20 pF; Value: 20 pF; ComponentLink2URL: https://content.kemet.com/datasheets/KEM_C1002_X7R_SMD.pdf; Digikey Description: CAP CER 20PF 50V 5% NP0 0402; Automotive: No
L1 = CMP-02424-000223-1: Fixed Inductors Commercial Low DCR Series SMT 1uH 4.5A 27mΩ 20%; DC Resistance (DCR): 27mR; Core Material: Ferrite; Test Frequency: 100kHz; Shielding: Shielded; Self Resonant Frequency: 64MHz; Saturation Current: 5A; Inductance Tolerance: 20%; Min Operating Temperature: -55°C; Lead Free: Lead Free; Inductance: 1uH; Contact Plating: Tin; Package Quantity: 4000; Military Standard: Not; Depth: 4.31mm; Tolerance: 20%; RMS Current (Irms): 4.5A; Packaging: Tape and Reel; Number of Pins: 1616; Case/Package: 1616; Termination: SMD/SMT; Height: 2mm; Current Rating: 4.5A; Case Code (Metric): 4040; Max Operating Temperature: 125°C; Case Code (Imperial): 1616; Max DC Current: 4.5A; Width: 0.16inch; Mount: Surface Mount; Length: 4.7mm; Radiation Hardening: No; Height - Seated (Max): 0.079inch
R1 R15 = CMP-2002-00965-1: Manufacturer: Panasonic; Part Number: ERJ-2RKF4990X
R19 R21 R26-R28 R30-R32 R34 R37 R40-R43 R45 R65 R66 = CMP-2002-04569-1: Manufacturer: KOA Speer; Part Number: RK73Z1ETTP
R46 R47 R63 R67 = CMP-2002-08136-3: RES Thick Film, 10kΩ, 5%, 0.063W, 200ppm/°C, 0402; Voltage Rating: 50V; Power Rating: 63mW; Military Standard: Not; Packaging: Tape and Reel; Case Code (Imperial): 0402; Min Operating Temperature: -55°C; Case Code (Metric): 1005; Temperature Coefficient: 200ppm/°C; Termination: SMD/SMT; Composition: Thick Film; Depth: 0.5mm; Number of Terminations: 2; Contact Plating: Tin; Height: 0.016inch; Width: 0.5mm; Max Operating Temperature: 155°C; Features: Automotive AEC-Q200; Length: 1mm; Radiation Hardening: No; Max Power Dissipation: 63mW; Mount: Surface Mount; Package Quantity: 1; Weight: 2.3E-05oz
R48 = CMP-1011-00659-2: Part Number: CRCW040222K0FKED; Manufacturer: Vishay Dale
R49 = CMP-1011-00429-3: RES Thick Film, 200Ω, 1%, 0.063W, 100ppm/°C, 0402; Max Power Dissipation: 63mW; Voltage Rating: 50V; Resistance: 200R; Termination: SMD/SMT; Weight: 2.3E-05oz; Case/Package: 0402; Contact Plating: Tin; Number of Pins: 2; Width: 0.5mm; Height: 0.35mm; Case Code (Metric): 1005; Military Standard: Not; Features: Automotive AEC-Q200; Power Rating: 63mW; Temperature Coefficient: 100ppm/°C; Tolerance: 1%; Lead Free: Lead Free; Depth: 0.5mm; Max Operating Temperature: 155°C; Min Operating Temperature: -55°C; Package Quantity: 10; Voltage Rating (DC): 50V; Composition: Thick Film; Mount: Surface Mount; Radiation Hardening: No; Length: 1mm; Packaging: Tape and Reel; Number of Terminations: 2; Case Code (Imperial): 0402
U6 = CMP-0378-00041-1: 16 Mbit SPI Serial Flash, 2.7 to 3.6 V, 50 MHz, 0 to 70 degC, 8-pin SOIC (S2A8), Tube; Manufacturer: Microchip; PackageReference: SOIC-S2A8; PackageVersion: Rev. A; ComponentLink3URL: http://ww1.microchip.com/downloads/en/DeviceDoc/25051A.pdf; ComponentLink1Description: Manufacturer URL; ComponentLink4URL: http://www.microchip.com/SST25VF016B; ComponentLink1URL: http://www.microchip.com; DatasheetVersion: Rev. A; ComponentLink2URL: http://ww1.microchip.com/downloads/en/DeviceDoc/25044A.pdf; PackageDescription: 8-Lead Plastic Small Outline Intergrated Circuit, 5.275 x 5.275 mm Body, 1.27 mm Pitch; PartNumber: SST25VF016B-50-4C-S2AF; ComponentLink3Description: Package Specification; ComponentLink2Description: Datasheet; Mounting Technology: Surface Mount; ComponentLink4Description: Product URL
Y1 = CMP-2000-05733-2: CRYSTAL 25.0000MHZ 18PF SMD; Manufacturer: Abracon; Stability: 30ppm; Frequency: 25MHz; Esr: 60Ω; Tolerance: 20ppm; Automotive: No; Series: ABM8G; Temperature Range High: +85°C; ComponentLink2URL: https://abracon.com/Resonators/ABM8G.pdf; RoHS: TRUE; Octopart: https://octopart.com/abm8g-25.000mhz-18-d2y-t-abracon-12676602; Package: ABM8G; Category: Crys; Device Class L2: Crystals / Oscillators; ComponentLink2Description: Datasheet; Manufacturer Part Number: ABM8G-25.000MHZ-18-D2Y-T; Height: 1mm; Lead Free: Yes; Digikey Description: CRYSTAL 25.0000MHZ 18PF SMD; Temperature Range Low: -40°C; Device Class L3: Crystals; Load Capacitance: 18pF; Temperature: -40°C to +85°C; Device Class L1: Passive Components; Mouser Description: Crystals 25.000MHz 18pF 30ppm -40C +85C

## Sheet 07-I225-2.SchDoc
size B; SheetNumber: 7; SheetTotal: 12
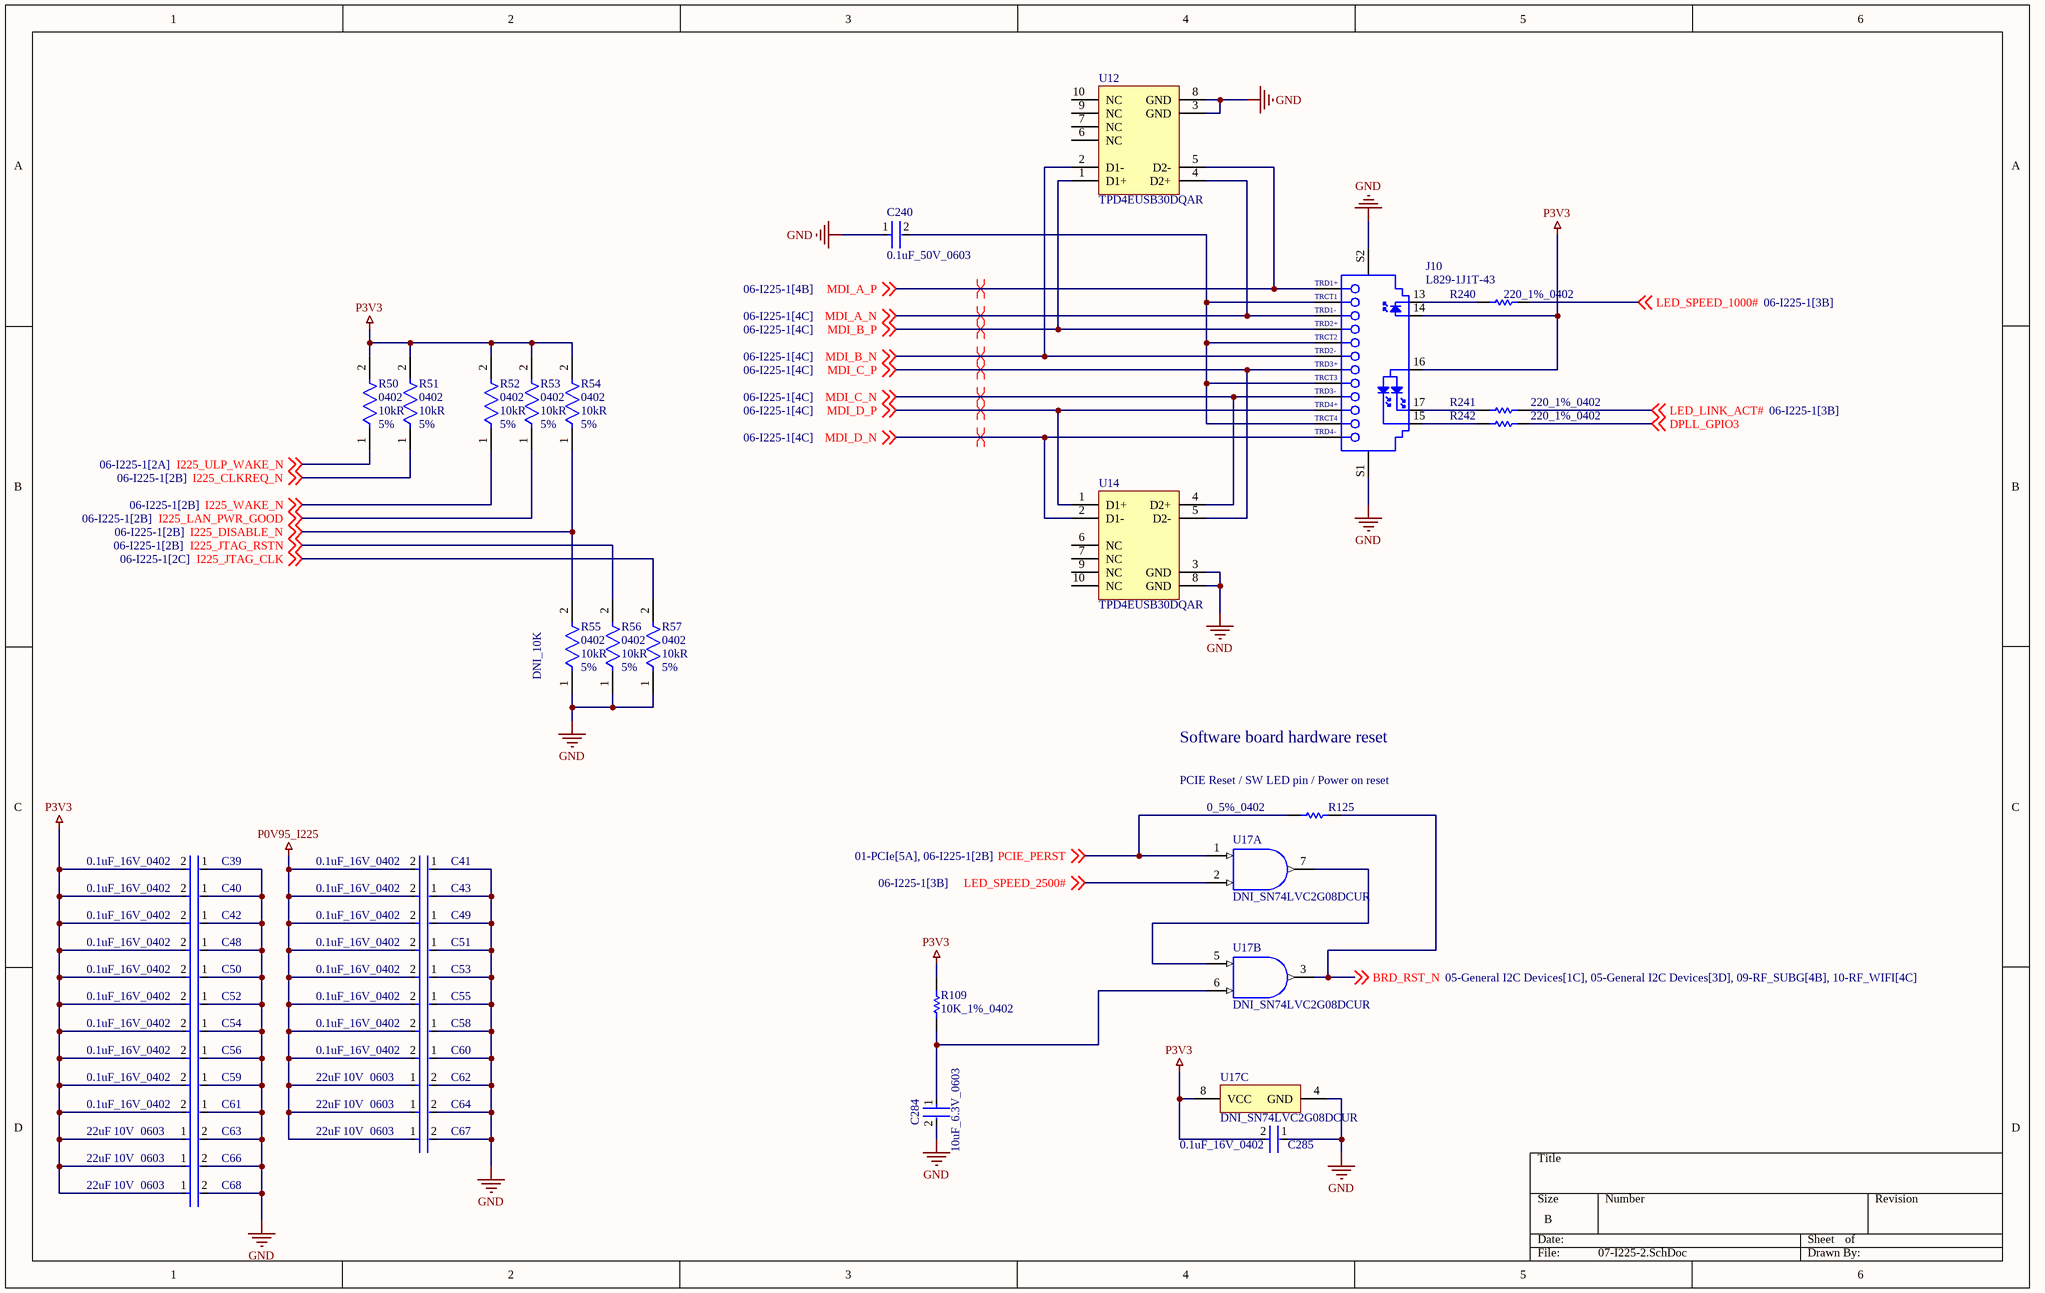
[diagram p4: 07-I225-2.SchDoc]

### Parts
C39  0.1uF_16V_0402  [FP-GRM15-MFG]
C40  0.1uF_16V_0402  [FP-GRM15-MFG]
C41  0.1uF_16V_0402  [FP-GRM15-MFG]
C42  0.1uF_16V_0402  [FP-GRM15-MFG]
C43  0.1uF_16V_0402  [FP-GRM15-MFG]
C48  0.1uF_16V_0402  [FP-GRM15-MFG]
C49  0.1uF_16V_0402  [FP-GRM15-MFG]
C50  0.1uF_16V_0402  [FP-GRM15-MFG]
C51  0.1uF_16V_0402  [FP-GRM15-MFG]
C52  0.1uF_16V_0402  [FP-GRM15-MFG]
C53  0.1uF_16V_0402  [FP-GRM15-MFG]
C54  0.1uF_16V_0402  [FP-GRM15-MFG]
C55  0.1uF_16V_0402  [FP-GRM15-MFG]
C56  0.1uF_16V_0402  [FP-GRM15-MFG]
C58  0.1uF_16V_0402  [FP-GRM15-MFG]
C59  0.1uF_16V_0402  [FP-GRM15-MFG]
C60  0.1uF_16V_0402  [FP-GRM15-MFG]
C61  0.1uF_16V_0402  [FP-GRM15-MFG]
C62  Capacitance: 22uF  Voltage Rating: 10V  Case Code (Imperial): 0603  [FP-GRM188-0_2-IPC_C]  (hidden comment: GRM188R61A226ME15D)
C63  Capacitance: 22uF  Voltage Rating: 10V  Case Code (Imperial): 0603  [FP-GRM188-0_2-IPC_C]  (hidden comment: GRM188R61A226ME15D)
C64  Capacitance: 22uF  Voltage Rating: 10V  Case Code (Imperial): 0603  [FP-GRM188-0_2-IPC_C]  (hidden comment: GRM188R61A226ME15D)
C66  Capacitance: 22uF  Voltage Rating: 10V  Case Code (Imperial): 0603  [FP-GRM188-0_2-IPC_C]  (hidden comment: GRM188R61A226ME15D)
C67  Capacitance: 22uF  Voltage Rating: 10V  Case Code (Imperial): 0603  [FP-GRM188-0_2-IPC_C]  (hidden comment: GRM188R61A226ME15D)
C68  Capacitance: 22uF  Voltage Rating: 10V  Case Code (Imperial): 0603  [FP-GRM188-0_2-IPC_C]  (hidden comment: GRM188R61A226ME15D)
C240  0.1uF_50V_0603  [FP-C0603-CJ-MFG]
C284  10uF_6.3V_0603  [FP-C0603C106M9PACTU-MFG]
C285  0.1uF_16V_0402  [FP-GRM15-MFG]
J10  L829-1J1T-43  [BELS-L829-1J1T-43_V]
R50  Case/Package: 0402  Resistance: 10kR  Tolerance: 5%  [FP-CRCW0402-e3-IPC_B]  (hidden comment: CRCW040210K0JNED)
R51  Case/Package: 0402  Resistance: 10kR  Tolerance: 5%  [FP-CRCW0402-e3-IPC_B]  (hidden comment: CRCW040210K0JNED)
R52  Case/Package: 0402  Resistance: 10kR  Tolerance: 5%  [FP-CRCW0402-e3-IPC_B]  (hidden comment: CRCW040210K0JNED)
R53  Case/Package: 0402  Resistance: 10kR  Tolerance: 5%  [FP-CRCW0402-e3-IPC_B]  (hidden comment: CRCW040210K0JNED)
R54  Case/Package: 0402  Resistance: 10kR  Tolerance: 5%  [FP-CRCW0402-e3-IPC_B]  (hidden comment: CRCW040210K0JNED)
R55  DNI_10K  Case/Package: 0402  Resistance: 10kR  Tolerance: 5%  [FP-CRCW0402-e3-IPC_B]  (no BOM)
R56  Case/Package: 0402  Resistance: 10kR  Tolerance: 5%  [FP-CRCW0402-e3-IPC_B]  (hidden comment: CRCW040210K0JNED)
R57  Case/Package: 0402  Resistance: 10kR  Tolerance: 5%  [FP-CRCW0402-e3-IPC_B]  (hidden comment: CRCW040210K0JNED)
R109  10K_1%_0402  [RESC1005X40X25NL10T10]
R125  0_5%_0402  [RESC1005X40X25LL10T10]
R240  220_1%_0402  [RESC1005X40X25LL10T10]
R241  220_1%_0402  [RESC1005X40X25LL10T10]
R242  220_1%_0402  [RESC1005X40X25LL10T10]
U12  TPD4EUSB30DQAR  [DQA0010A_V]
U14  TPD4EUSB30DQAR  [DQA0010A_V]
U17  DNI_SN74LVC2G08DCUR  [DCU0008A_M]  (parts A,B,C of 3)  (no BOM)

### Nets
GND: C39.1 C40.1 C41.1 C42.1 C43.1 C48.1 C49.1 C50.1 C51.1 C52.1 C53.1 C54.1 C55.1 C56.1 C58.1 C59.1 C60.1 C61.1 C62.2 C63.2 C64.2 C66.2 C67.2 C68.2 C240.1 C284.2 C285.1 J10.S1 J10.S2 R55.1 R56.1 R57.1 U12.3(GND) U12.8(GND) U14.3(GND) U14.8(GND) U17.4(GND)
P0V95_I225: C41.2 C43.2 C49.2 C51.2 C53.2 C55.2 C58.2 C60.2 C62.1 C64.1 C67.1
P3V3: C39.2 C40.2 C42.2 C48.2 C50.2 C52.2 C54.2 C56.2 C59.2 C61.2 C63.1 C66.1 C68.1 C285.2 J10.14 J10.16 R50.2 R51.2 R52.2 R53.2 R54.2 R109.2 U17.8(VCC)
BRD_RST_N: R125.2 U17.3(2Y) ; off-sheet BRD_RST_N
DPLL_GPIO3: R242.2 ; off-sheet DPLL_GPIO3
I225_CLKREQ_N: R51.1 ; off-sheet I225_CLKREQ_N
I225_DISABLE_N: R54.1 R55.2 ; off-sheet I225_DISABLE_N
I225_JTAG_CLK: R57.2 ; off-sheet I225_JTAG_CLK
I225_JTAG_RSTN: R56.2 ; off-sheet I225_JTAG_RSTN
I225_LAN_PWR_GOOD: R53.1 ; off-sheet I225_LAN_PWR_GOOD
I225_ULP_WAKE_N: R50.1 ; off-sheet I225_ULP_WAKE_N
I225_WAKE_N: R52.1 ; off-sheet I225_WAKE_N
LED_LINK_ACT#: R241.2 ; off-sheet LED_LINK_ACT#
LED_SPEED_1000#: R240.2 ; off-sheet LED_SPEED_1000#
LED_SPEED_2500#: U17.2(1B) ; off-sheet LED_SPEED_2500#
MDI_A_N: J10.3(TRD1-) U12.4(D2+) ; off-sheet MDI_A_N
MDI_A_P: J10.1(TRD1+) U12.5(D2-) ; off-sheet MDI_A_P
MDI_B_N: J10.6(TRD2-) U12.2(D1-) ; off-sheet MDI_B_N
MDI_B_P: J10.4(TRD2+) U12.1(D1+) ; off-sheet MDI_B_P
MDI_C_N: J10.9(TRD3-) U14.4(D2+) ; off-sheet MDI_C_N
MDI_C_P: J10.7(TRD3+) U14.5(D2-) ; off-sheet MDI_C_P
MDI_D_N: J10.12(TRD4-) U14.2(D1-) ; off-sheet MDI_D_N
MDI_D_P: J10.10(TRD4+) U14.1(D1+) ; off-sheet MDI_D_P
PCIE_PERST: R125.1 U17.1(1A) ; off-sheet PCIE_PERST
NetC240_2: C240.2 J10.2(TRCT1) J10.5(TRCT2) J10.8(TRCT3) J10.11(TRCT4)
NetC284_1: C284.1 R109.1 U17.6(2B)
NetJ10_13: J10.13 R240.1
NetJ10_15: J10.15 R242.1
NetJ10_17: J10.17 R241.1
NetU17_5: U17.5(2A) U17.7(1Y)

Not connected (* = marked no-connect by the designer): U12 6(NC) 7(NC) 9(NC) 10(NC); U14 6(NC) 7(NC) 9(NC) 10(NC)

### Layout directives
differential pair: MDI_A_N, MDI_A_P, MDI_B_N, MDI_B_P, MDI_C_N, MDI_C_P, MDI_D_N, MDI_D_P

### Notes on the sheet
- Software board hardware reset
- (near R125) PCIE Reset / SW LED pin / Power on reset

### Library data of the parts
C39-C43 C48-C56 C58-C61 C285 = CMP-2100-03641-2: as C38 on sheet 06-I225-1; RoHS: TRUE; Temperature Characteristic: X7R; Octopart: https://octopart.com/grm155r71c104ka88d-murata-196880; Digikey Description: CAP CER 0.1UF 16V X7R 0402; Device Class L3: Ceramic Capacitors; Height: 0.55mm; ComponentLink2Description: Datasheet; Temperature Range Low: -55°C; Ipc Land Pattern Name: CAPC10050X219; ComponentLink2URL: https://search.murata.co.jp/Ceramy/image/img/A01X/G101/ENG/GRM155R71H471KA01-01A.pdf; Device Class L1: Passive Components; Lead Free: yes; Category: Cap; Package: GRM15; Temperature: -55°C to +125°C; Device Class L2: Capacitors; Temperature Range High: +125°C; Mouser Description: 0402 0.1 uF 16V ±10 % Tolerance X7R SMT Multilayer Ceramic Capacitor
C62-C64 C66-C68 = CMP-2000-06337-3: Chip Multilayer Ceramic Capacitors for General Purpose, 0603, 22uF, X5R, 15%, 20%, 10V; Tolerance: 20%; Weight: 0.000222oz; Material: Ceramic; Depth: 0.8mm; Length: 1.6mm; Termination: SMD/SMT; Packaging: Tape and Reel; Width: 0.8mm; Mount: Surface Mount; Voltage Rating (DC): 10V; Case/Package: 0603; Thickness: 0.039inch; REACH SVHC: No SVHC; Dielectric: X5R; Height: 0.8mm; Package Quantity: 4000; Case Code (Metric): 1608; Min Operating Temperature: -55°C; Lead Free: Lead Free; Max Operating Temperature: 85°C
C240 = CMP-2006-03300-2: CAP CER 0.1UF 50V X7R 0603; Manufacturer Part Number: C0603X104K5RACTU; Manufacturer: Kemet; Capacitance: 100nF; Material: Ceramic; Tolerance: 10%; Value: 100nF; Temperature Coefficient: 15%; Temperature Range High: +125°C; Temperature Range Low: -55°C; Voltage: 50V; ComponentLink2Description: Datasheet; RoHS: TRUE; ComponentLink2URL: https://content.kemet.com/datasheets/KEM_C1013_X7R_FT-CAP_SMD.pdf; Device Class L3: Ceramic Capacitors; Device Class L2: Capacitors; Package: C0603-CJ; Height: 0.95mm; Device Class L1: Passive Components; Temperature Characteristic: X7R; Lead Free: Yes; Digikey Description: CAP CER 0.1UF 50V X7R 0603; Automotive: No; Mouser Description: Capacitor; Ceramic; Cap 0.1uF; Tol+10%; SMT; Flexible Termination; Vol-Rtg 50V; TR; Temperature: -55°C to +125°C; Octopart: https://octopart.com/c0603x104k5ractu-kemet-9145062; Category: Cap; Voltage Rating: 50V; Ipc Land Pattern Name: CAPC16080X80
C284 = CMP-2006-02285-3: as C96 on sheet 04-Front Panel SFP_2; Category: Cap; Height: 0.9mm; Digikey Description: CAP CER 10UF 6.3V X5R 0603; Mouser Description: In a Pack of 10, KEMET 0603 (1608M) 10µF MLCC 6.3V dc ±20% SMD C0603C106M9PACTU; Voltage Rating: 6.3V; Device Class L2: Capacitors; Temperature Range Low: -55°C; Temperature Characteristic: X5R; ComponentLink2Description: Datasheet; Ipc Land Pattern Name: CAPC16080X80; ComponentLink2URL: http://www.kemet.com/Lists/ProductCatalog/Attachments/19/KEM_C1006_X5R_SMD.pdf; Capacitance: 10uF; Temperature Range High: +85°C; Device Class L3: Ceramic Capacitors; RoHS: TRUE; Automotive: No; Value: 10uF; Temperature: -55°C to +85°C; Device Class L1: Passive Components; Package: C0603C106M9PACTU; Lead Free: Yes; Octopart: https://octopart.com/c0603c106m9pactu-kemet-8375727
J10 = CMP-1715-00001-1: Gigabit MagJack(R) Ultra Low Profile, 10/100/1000 Base-T, 19-Pin THD, RoHS, Tray; Width: 24.13 mm; RoHSCompliant: True; PartNumber: L829-1J1T-43; Case/Package: Metal; Mount: Through Hole; ComponentLink1Description: Manufacturer URL; Height: 11.3 mm; Package Quantity: 60; Packaging: Tray; Length: 17.78 mm; PackageDescription: 19-Pin Through Hole Device, Body 23.94 x 17.58 mm, Pitch 2.03 mm; ComponentLink2URL: http://belfuse.com/pdfs/L829-1J1T-43.pdf; ComponentLink1URL: http://belfuse.com/ethernet/; Mounting Technology: Through Hole; DatasheetVersion: Rev. G; Pins: 8; ComponentLink2Description: Datasheet
R50-R57 = CMP-2002-08136-3: as R46 on sheet 06-I225-1; Military Standard: Not; Packaging: Tape and Reel; Case Code (Imperial): 0402; Min Operating Temperature: -55°C; Case Code (Metric): 1005; Temperature Coefficient: 200ppm/°C; Termination: SMD/SMT; Composition: Thick Film; Depth: 0.5mm; Number of Terminations: 2; Contact Plating: Tin; Height: 0.016inch; Width: 0.5mm; Max Operating Temperature: 155°C; Features: Automotive AEC-Q200; Length: 1mm; Radiation Hardening: No; Max Power Dissipation: 63mW; Mount: Surface Mount; Package Quantity: 1; Weight: 2.3E-05oz
R109 = CMP-2002-04694-1: Manufacturer: Bourns; Part Number: CR0402-FX-1002GLF
R125 = CMP-2002-04569-1: as R19 on sheet 06-I225-1
R240-R242 = CMP-2002-03891-1: Part Number: RK73H1ETTP2200F; Manufacturer: KOA Speer
U12 U14 = CMP-0326-00027-3: ESD Solution for Super-Speed (6 GBPS) USB 3.0 Interface, 4 Channels, -40 to +85 degC, 10-pin SON (DQA), Green (RoHS & no Sb/Br); Manufacturer: Texas Instruments; Differential Capacitance(pF): 0.05; Serial ATA / eSATA: TRUE; IO Capacitance(Typ)(pF): 0.8; IO Leakage Current(nA): 10; IEC 61000-4-2 Air-Gap(+/- kV): 8; ComponentLink3Description: URL Link1; PartNumber: TPD4EUSB30DQAR; DatasheetVersion: SLVSAC2C; ComponentLink2URL: http://www.ti.com/general/docs/lit/getliterature.tsp?genericPartNumber=TPD4EUSB30&fileType=pdf; USB Super Speed: TRUE; Eco-Plan: Green (RoHS & no Sb/Br); Mounting Technology: Surface Mount; 1394 / Firewire: TRUE; PackageVersion: revB, Sep-2009; SubFamily: ESD Solution; USB Full Speed: TRUE; USB High Speed: TRUE; ComponentLink2Description: Datasheet; ComponentLink1URL: http://www.ti.com/; IEC 61000-4-2 Contact(+/- kV): 8; Breakdown Voltage(Min)(V): 8; PackageReference: DQA0010A; ComponentLink1Description: Manufacturer URL; PackageDescription: 10-Pin Plastic Small Outline No-Lead, 1 x 2.5 x 0.55 mm Body, 0.5 mm Pitch; ComponentLink3URL: SamplesURL:http://www.ti.com/product/tpd4eusb30#samples; HDMI: TRUE
U17 = CMP-0859-00670-3: Dual 2-Input Positive-AND Gate, DCU0008A, LARGE T&R; Manufacturer: Texas Instruments; Logic: True; Output Drive (IOL/IOH)(Max)(mA): 32/-32; F @ Nom Voltage(Max)(Mhz): 150; Technology Family: LVC; Rating: Catalog; tpd @ Nom Voltage(Max)(ns): 9.8,5.8,5.3,4.8; Voltage(Nom)(V): 1.8,2.5,3.3,5; Schmitt Trigger: No; Input Type: CMOS/TTL; Bits(#): 2; Gate Type: AND; VCC(Max)(V): 5.5; VCC(Min)(V): 1.65; ICC @ Nom Voltage(Max)(mA): 0.01; Output Type: CMOS; Sub-Family: AND Gate; PackageReference: DCU0008A; Operating Temperature Range(C): -40 to 125,-40 to 85; 3-State Output: No; DatasheetVersion: SCES198M; Generic Part Number: SN74LVC2G08